# EAGLE schematic jr-support_v4 (EAGLE 8.2.2)
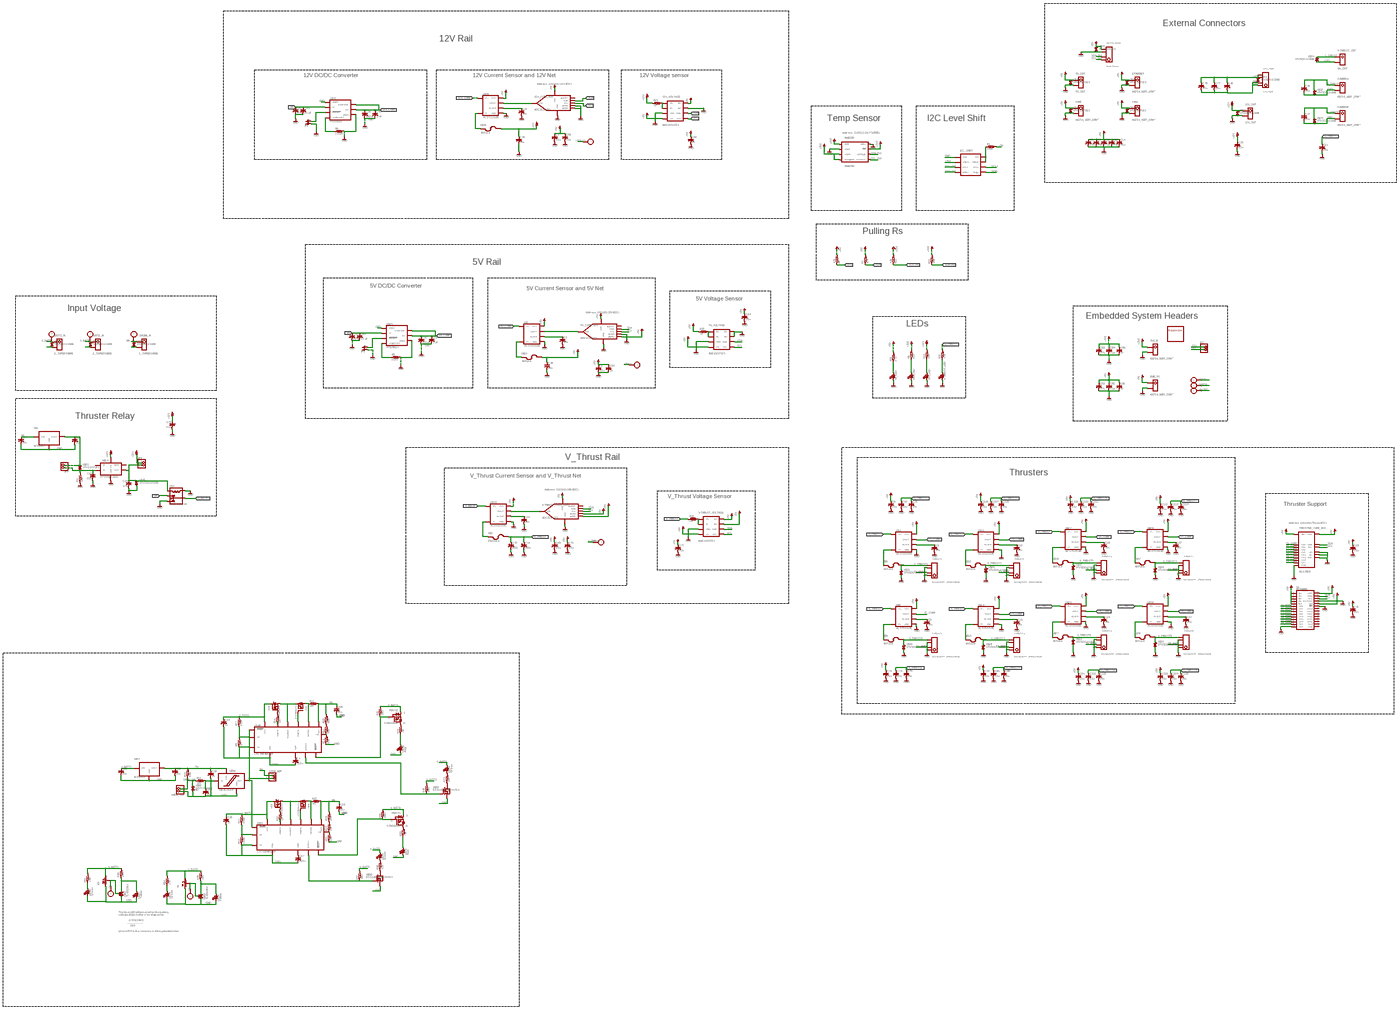
[diagram p0: schematic, sheet 1, overview]
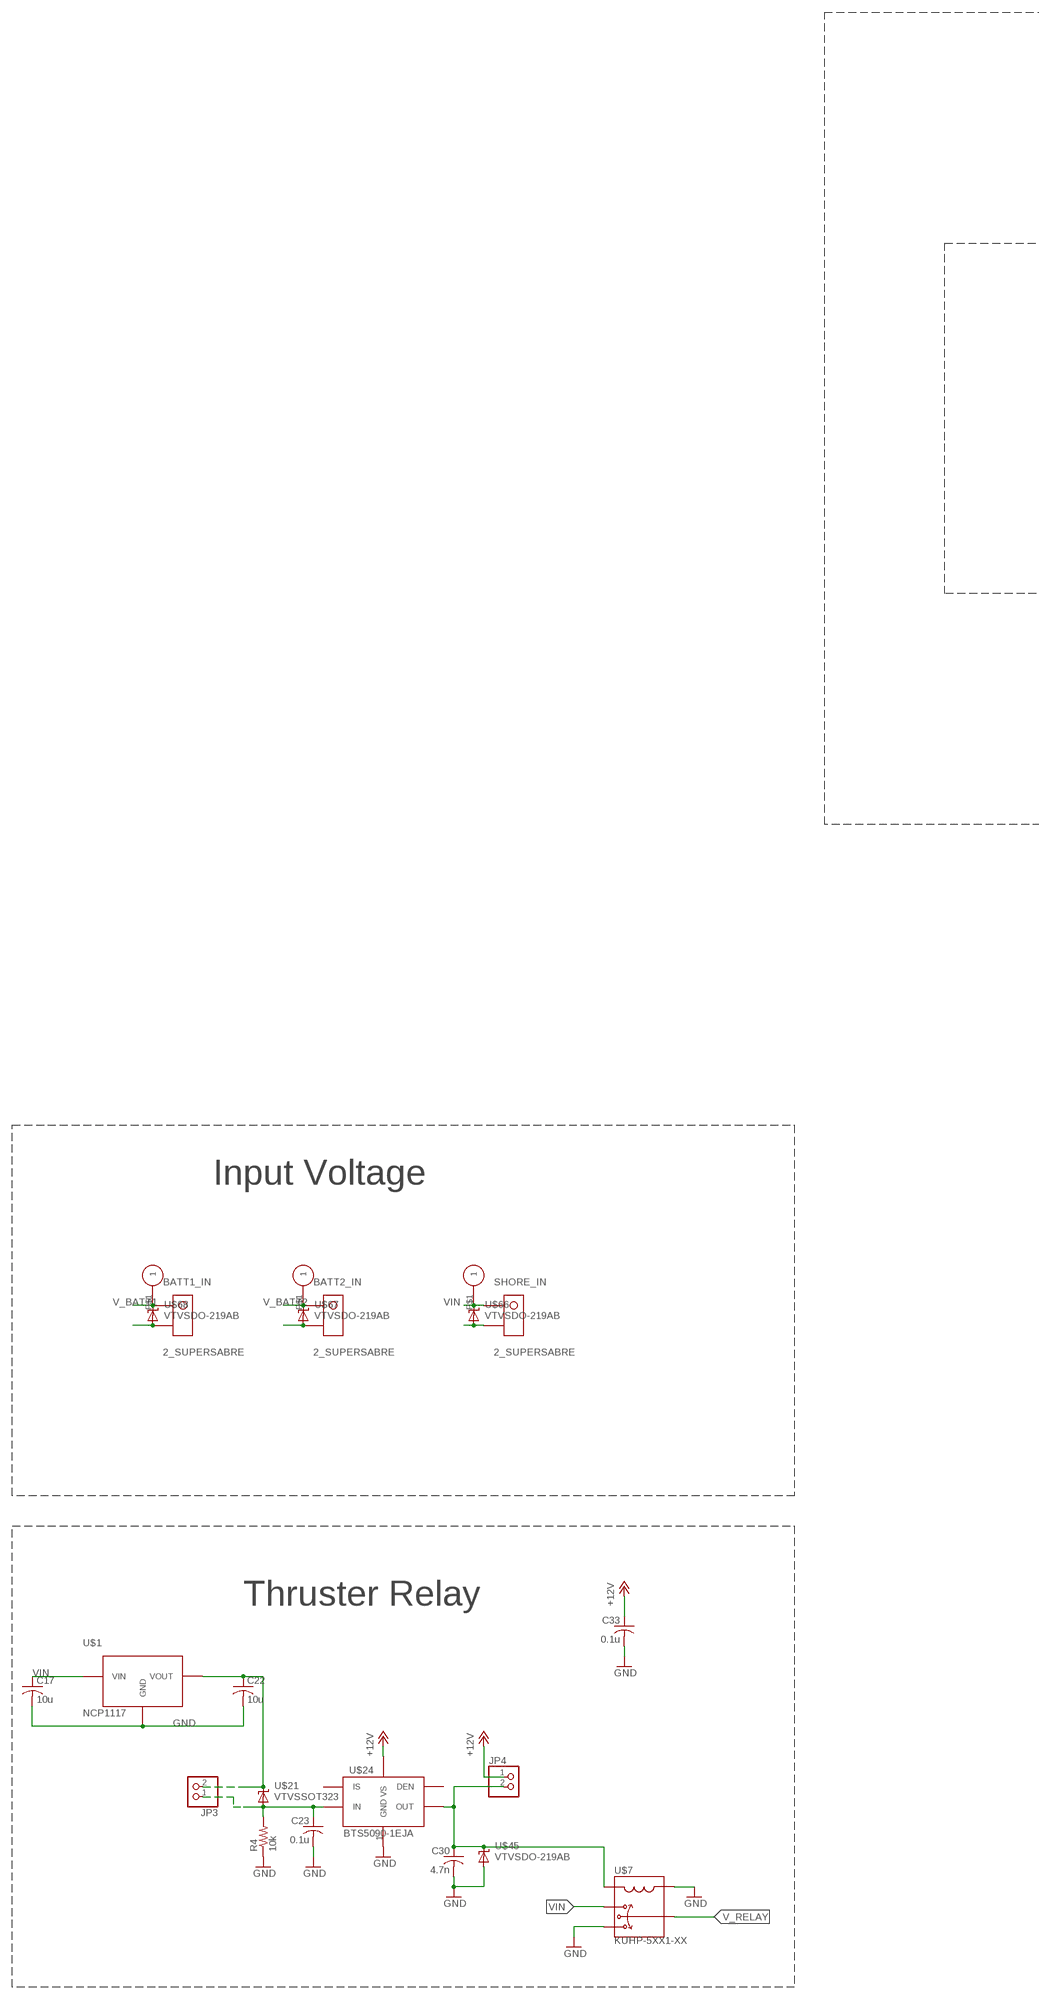
[diagram p1: schematic, sheet 1, part 1 of 8]
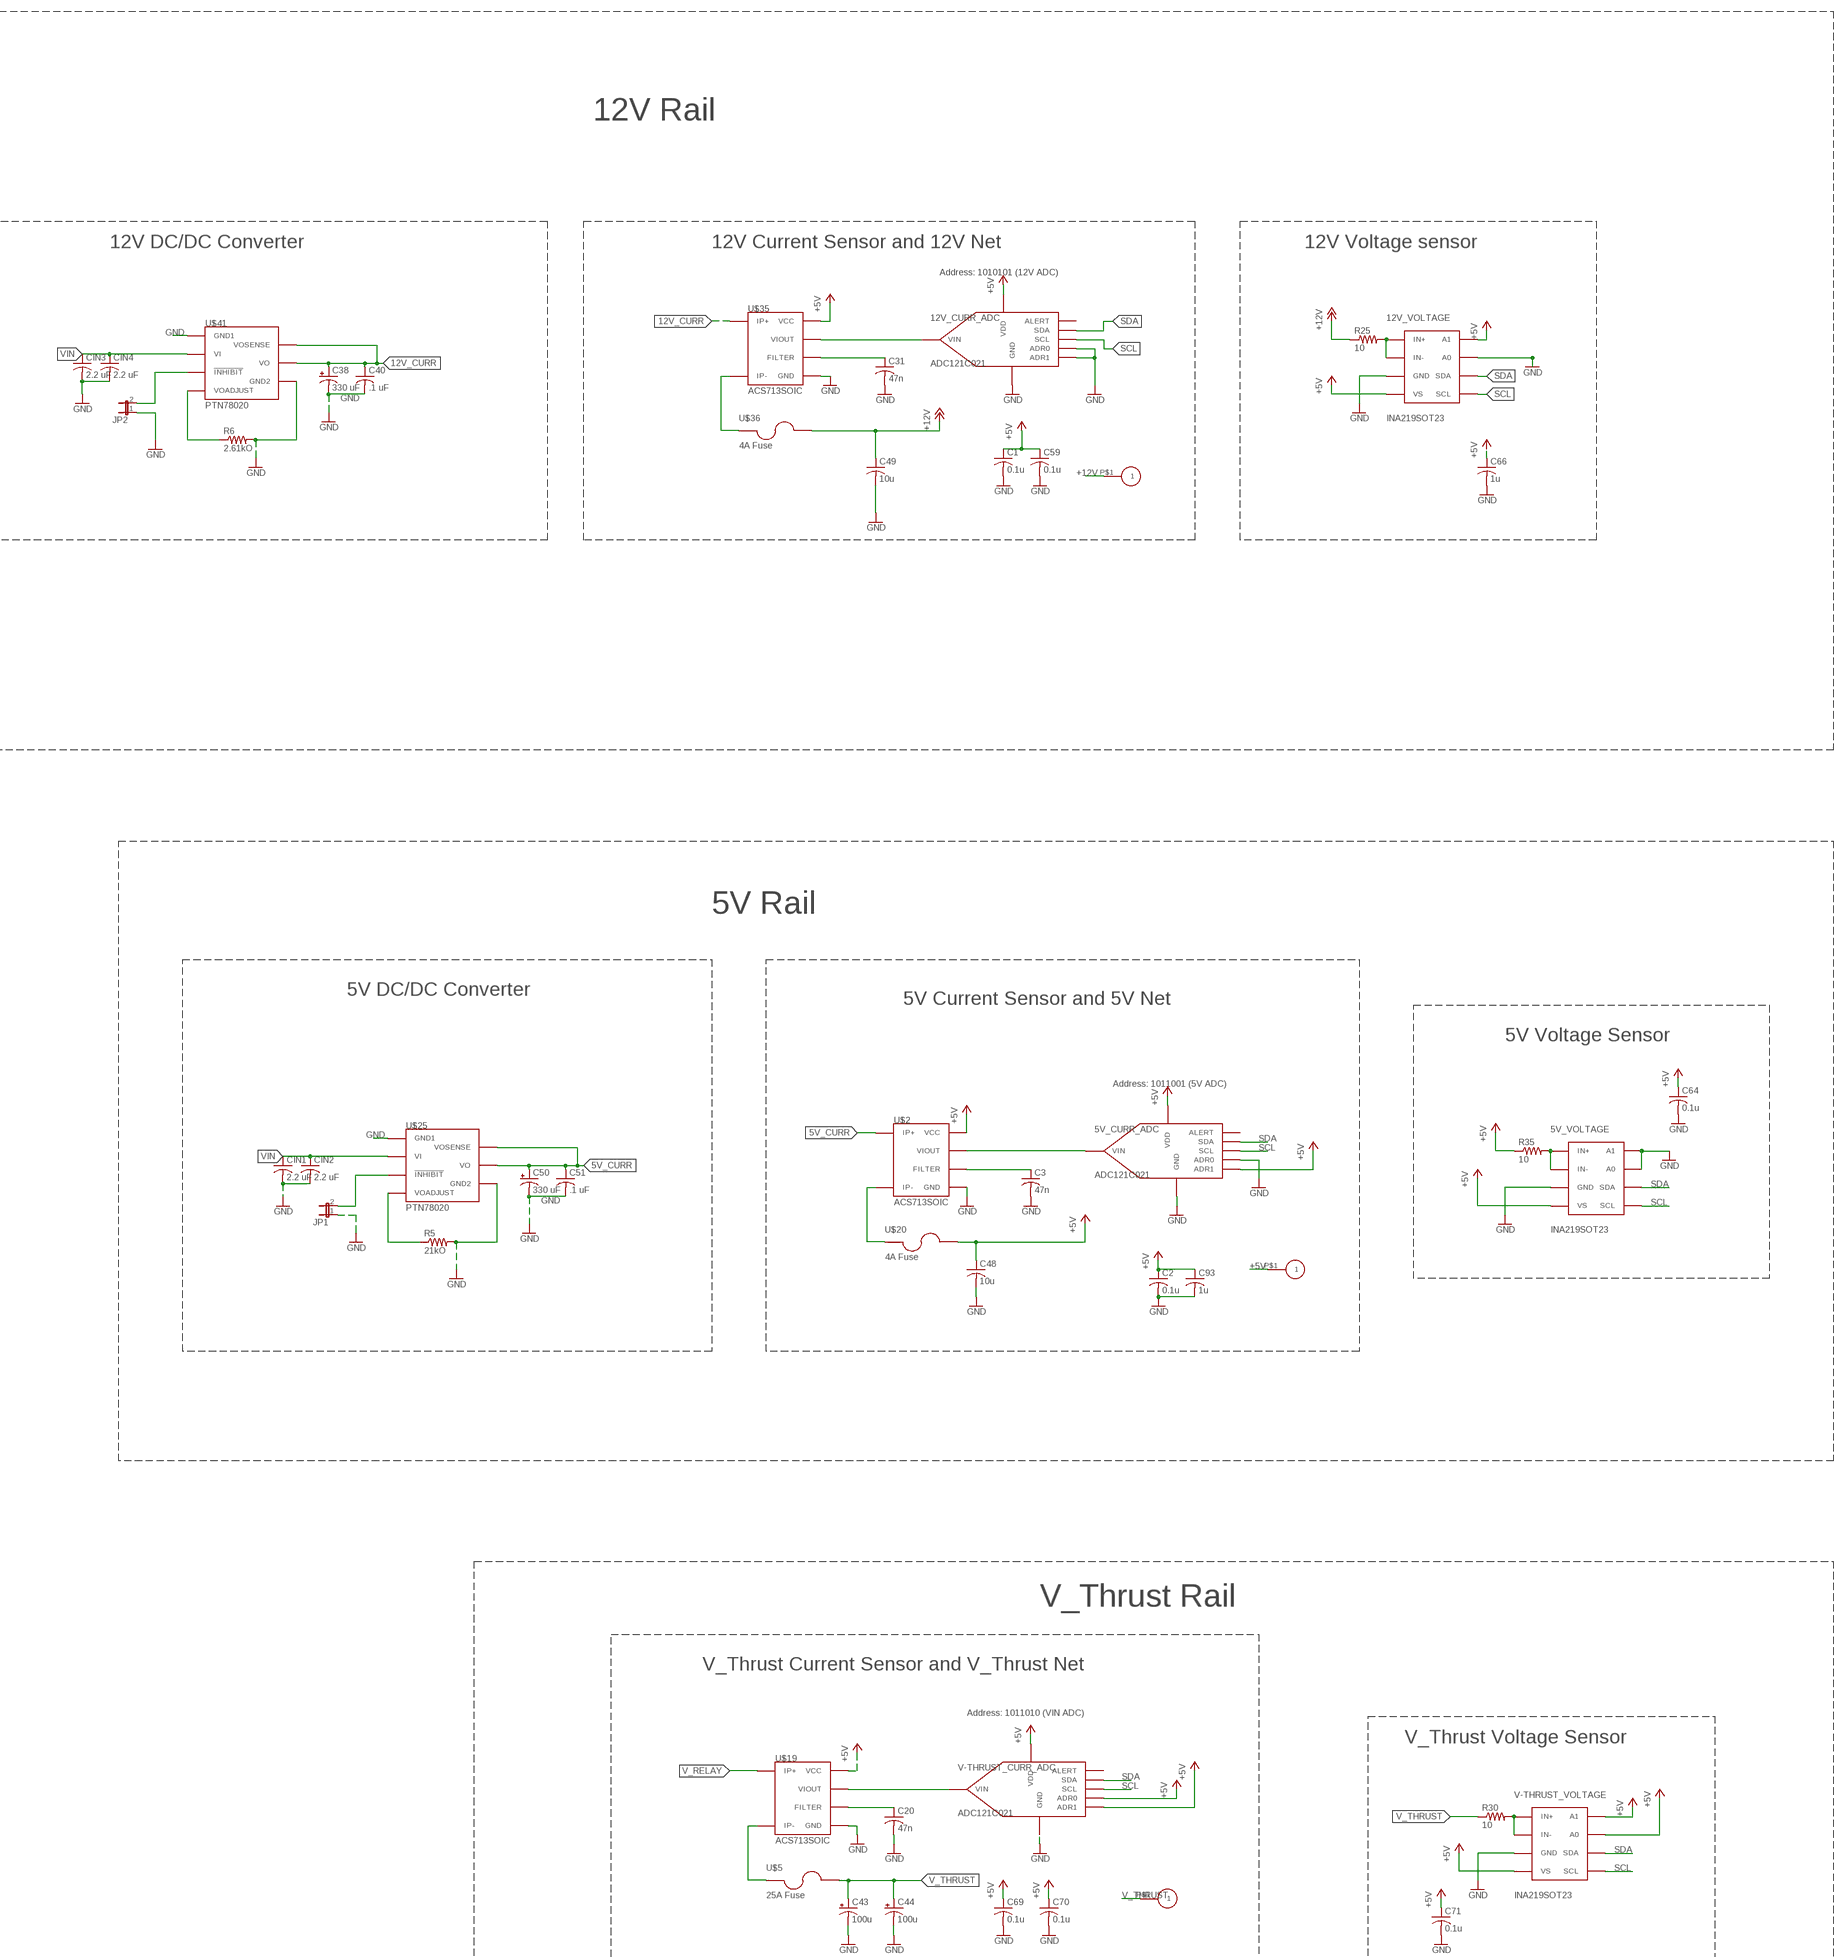
[diagram p2: schematic, sheet 1, part 2 of 8]
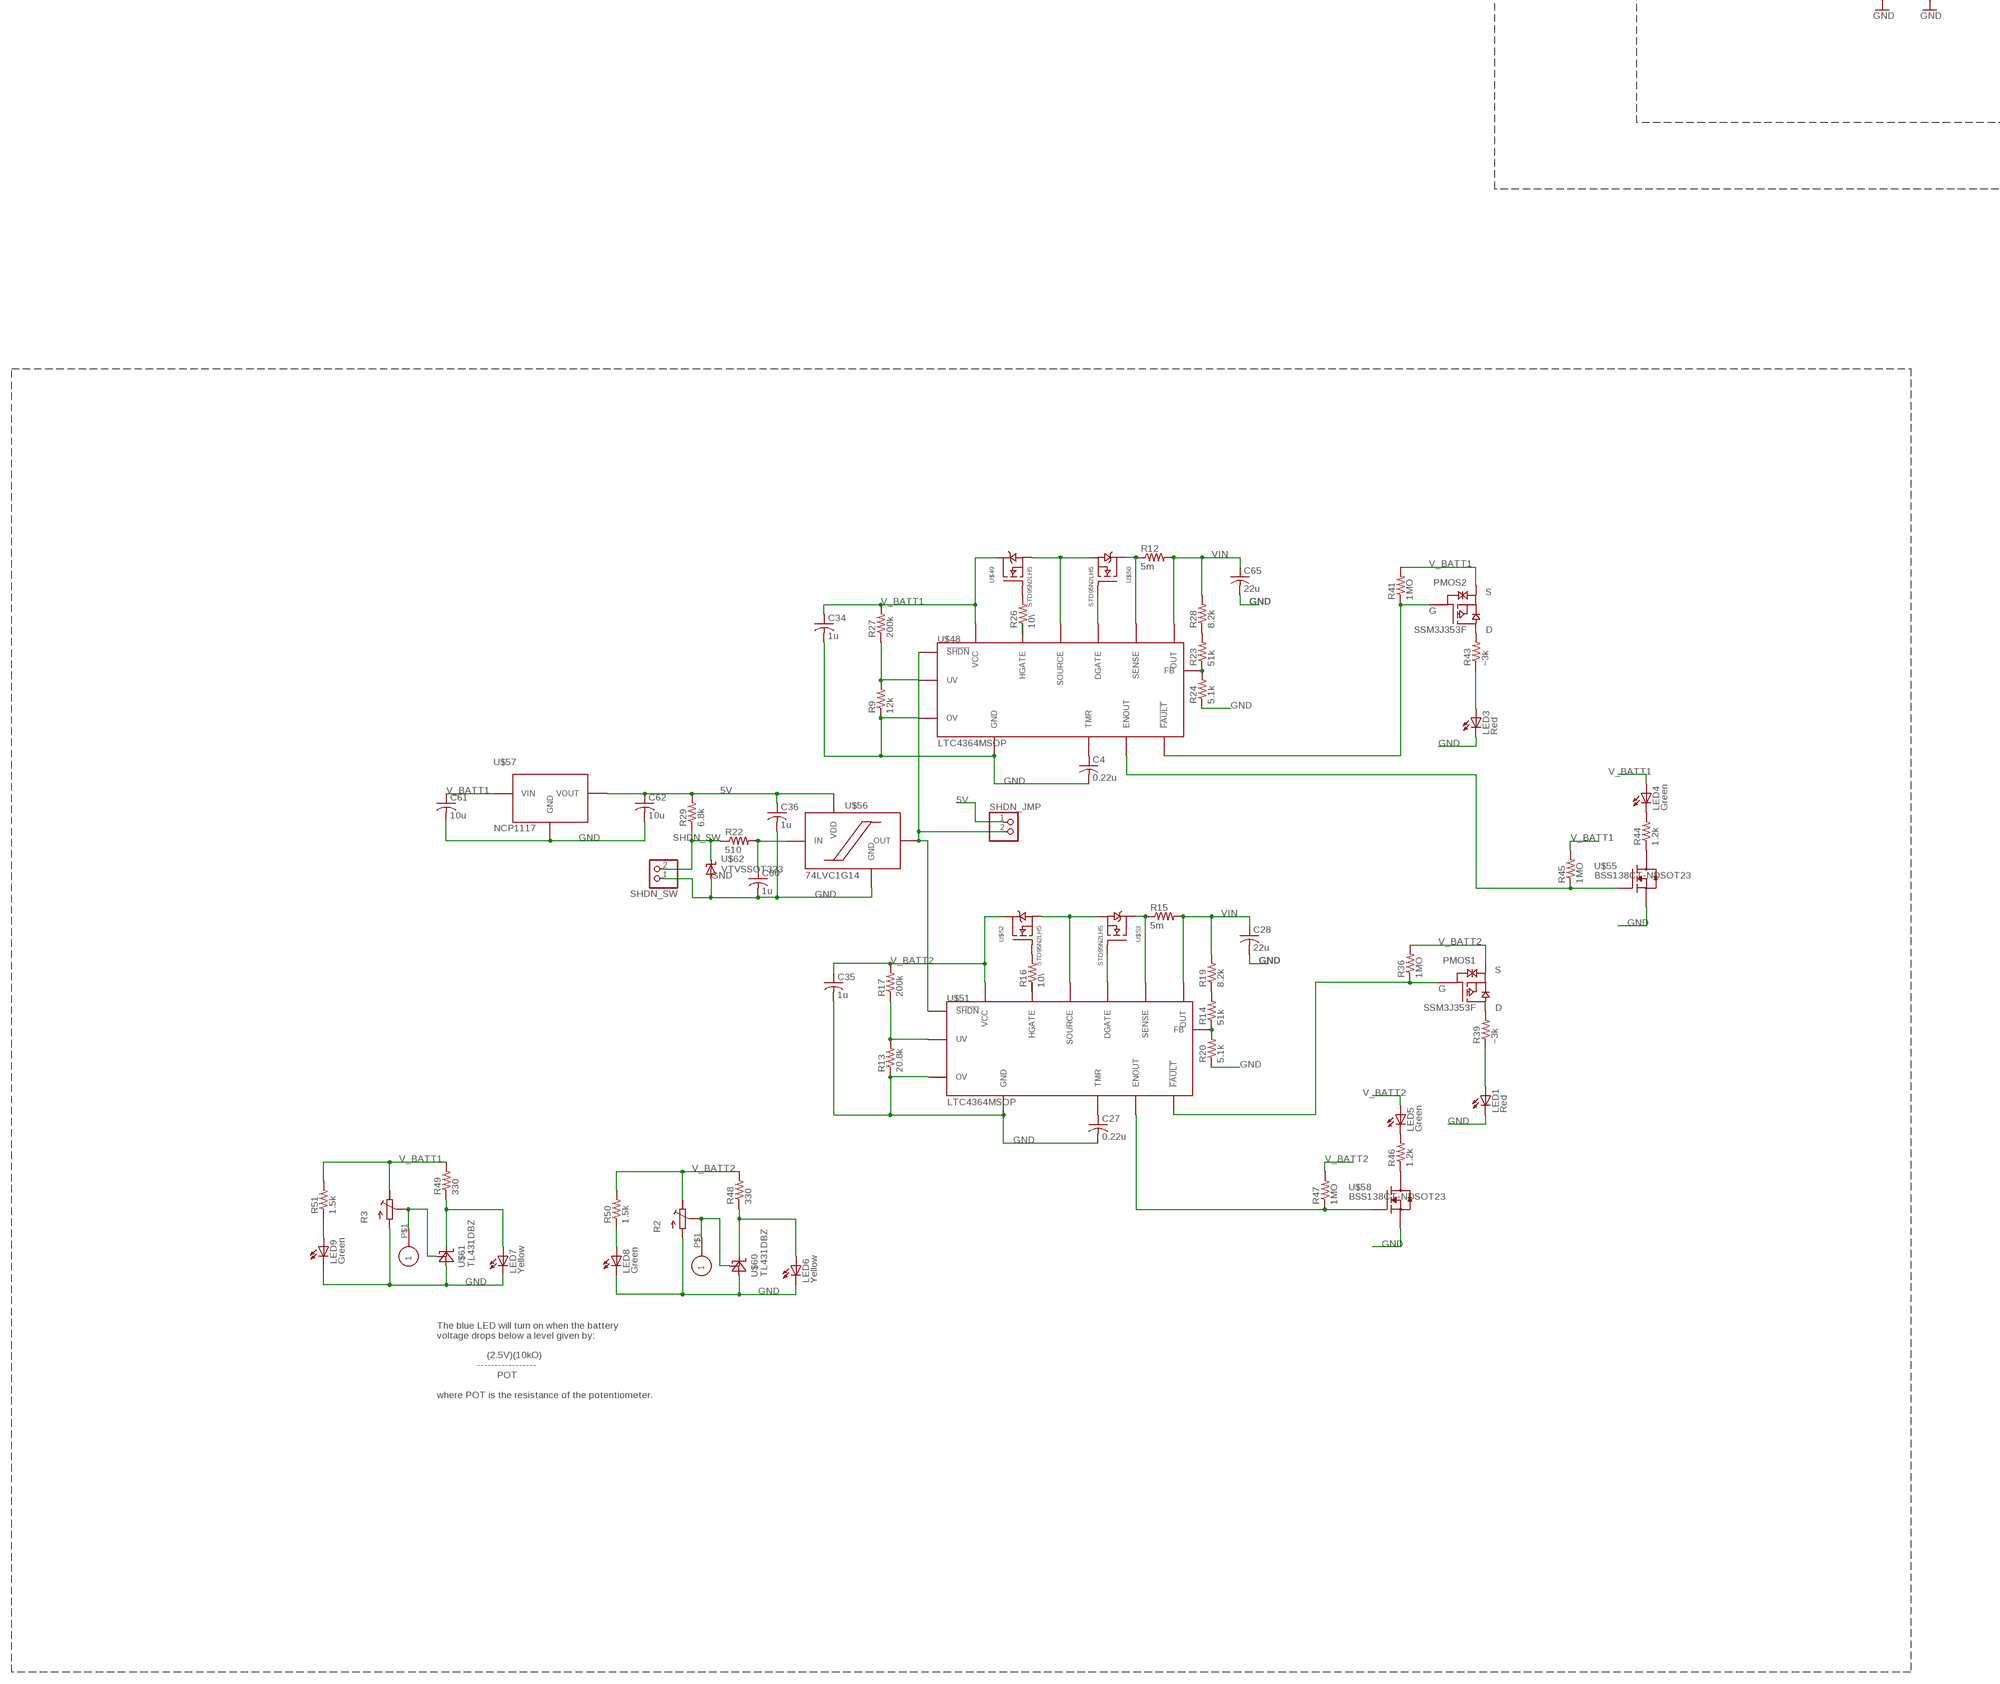
[diagram p3: schematic, sheet 1, part 3 of 8]
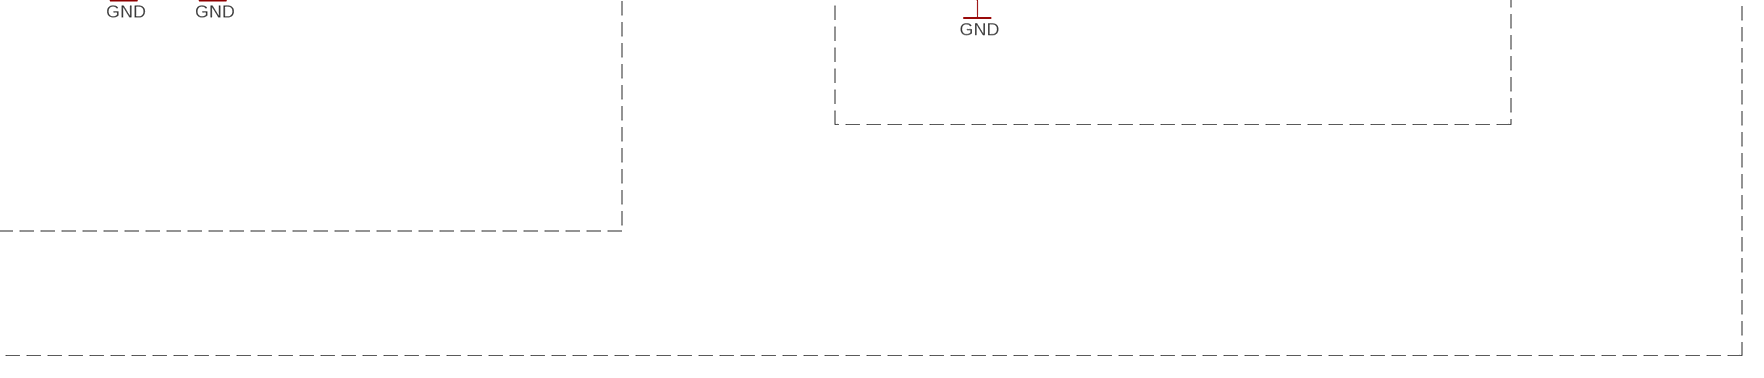
[diagram p4: schematic, sheet 1, part 4 of 8]
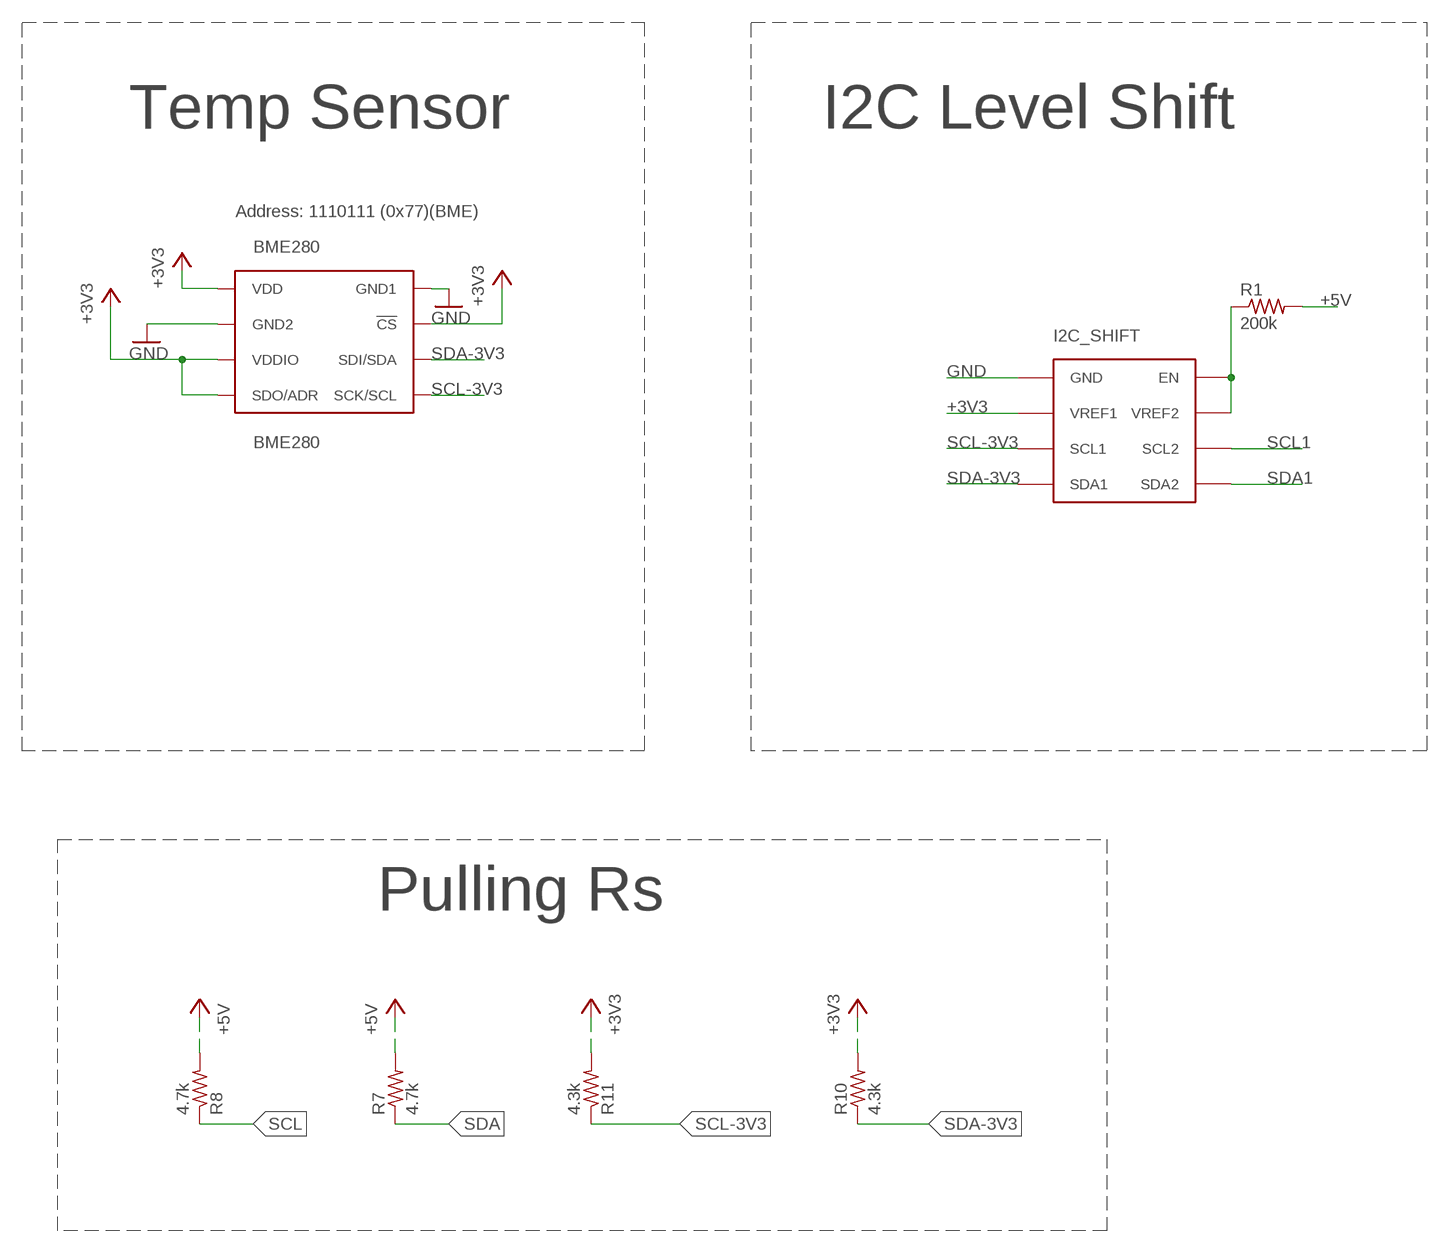
[diagram p5: schematic, sheet 1, part 5 of 8]
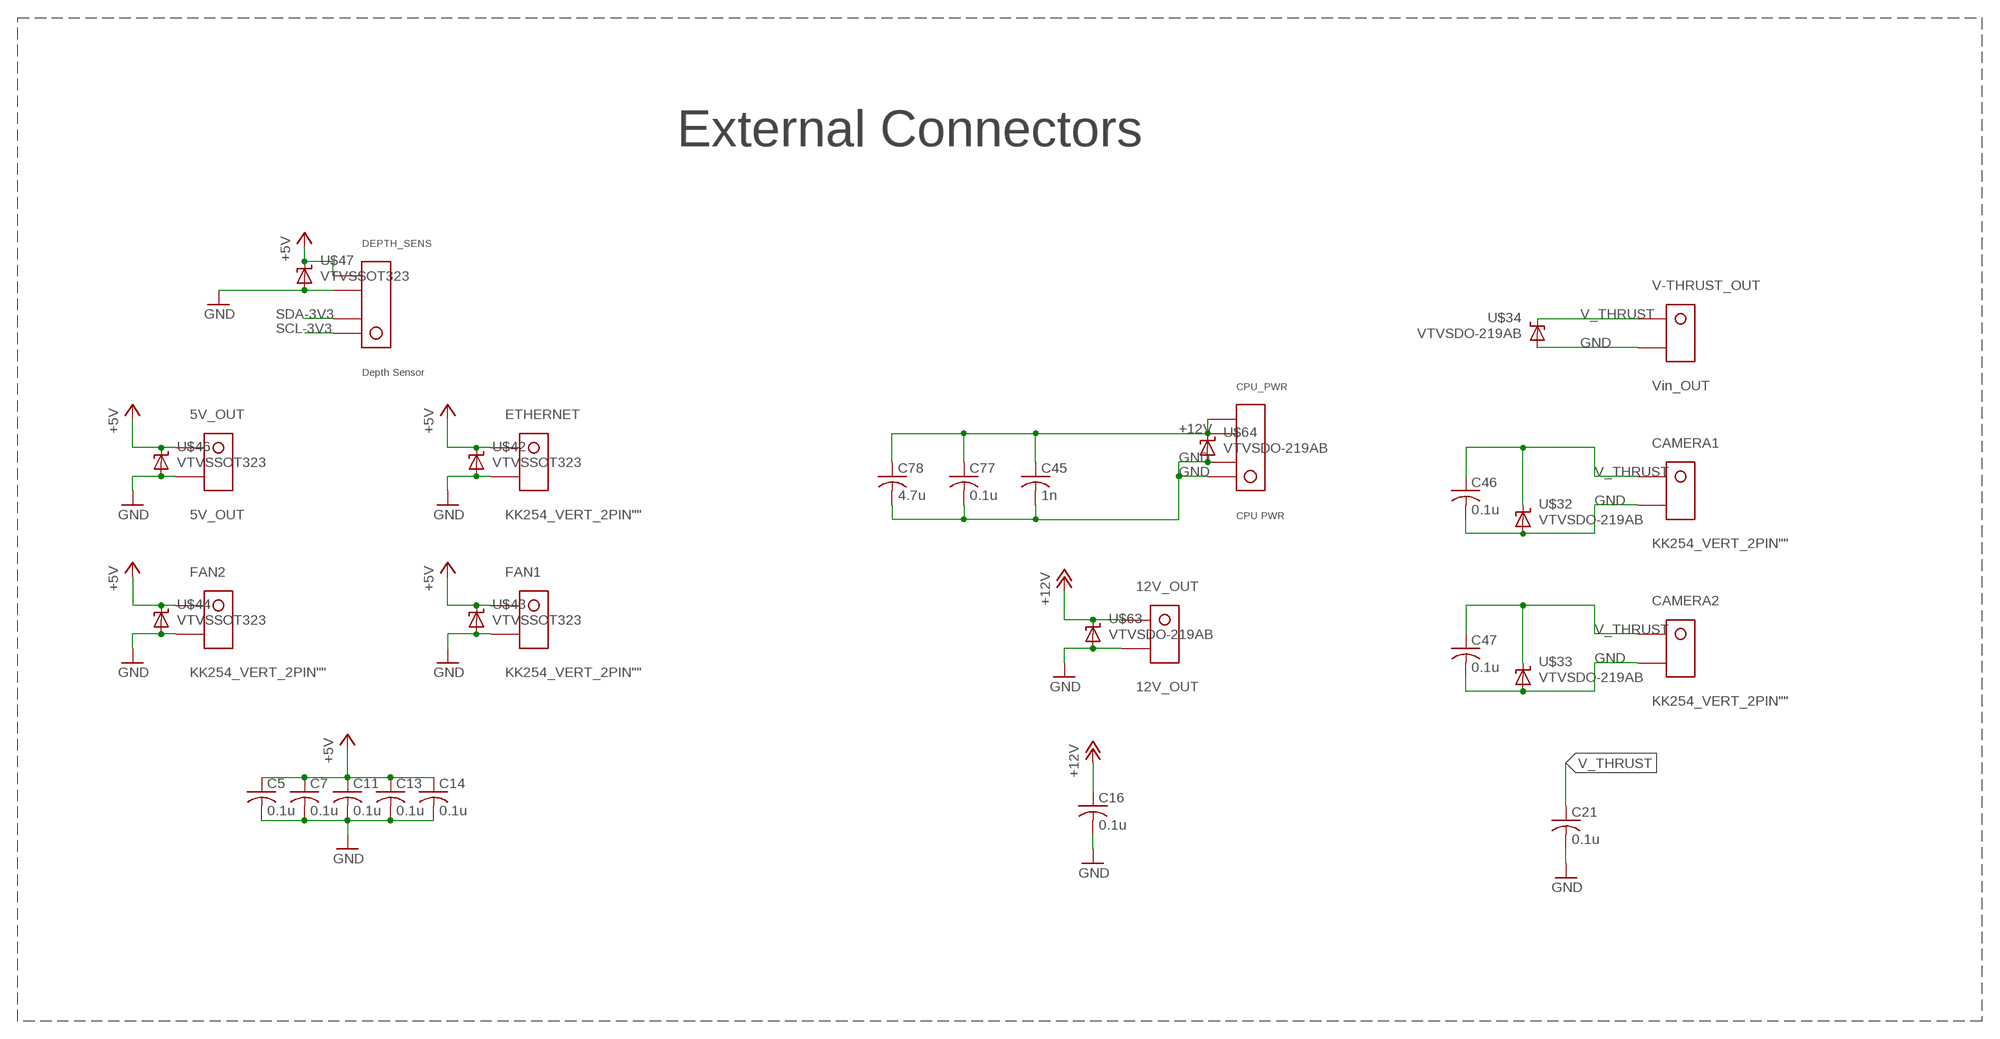
[diagram p6: schematic, sheet 1, part 6 of 8]
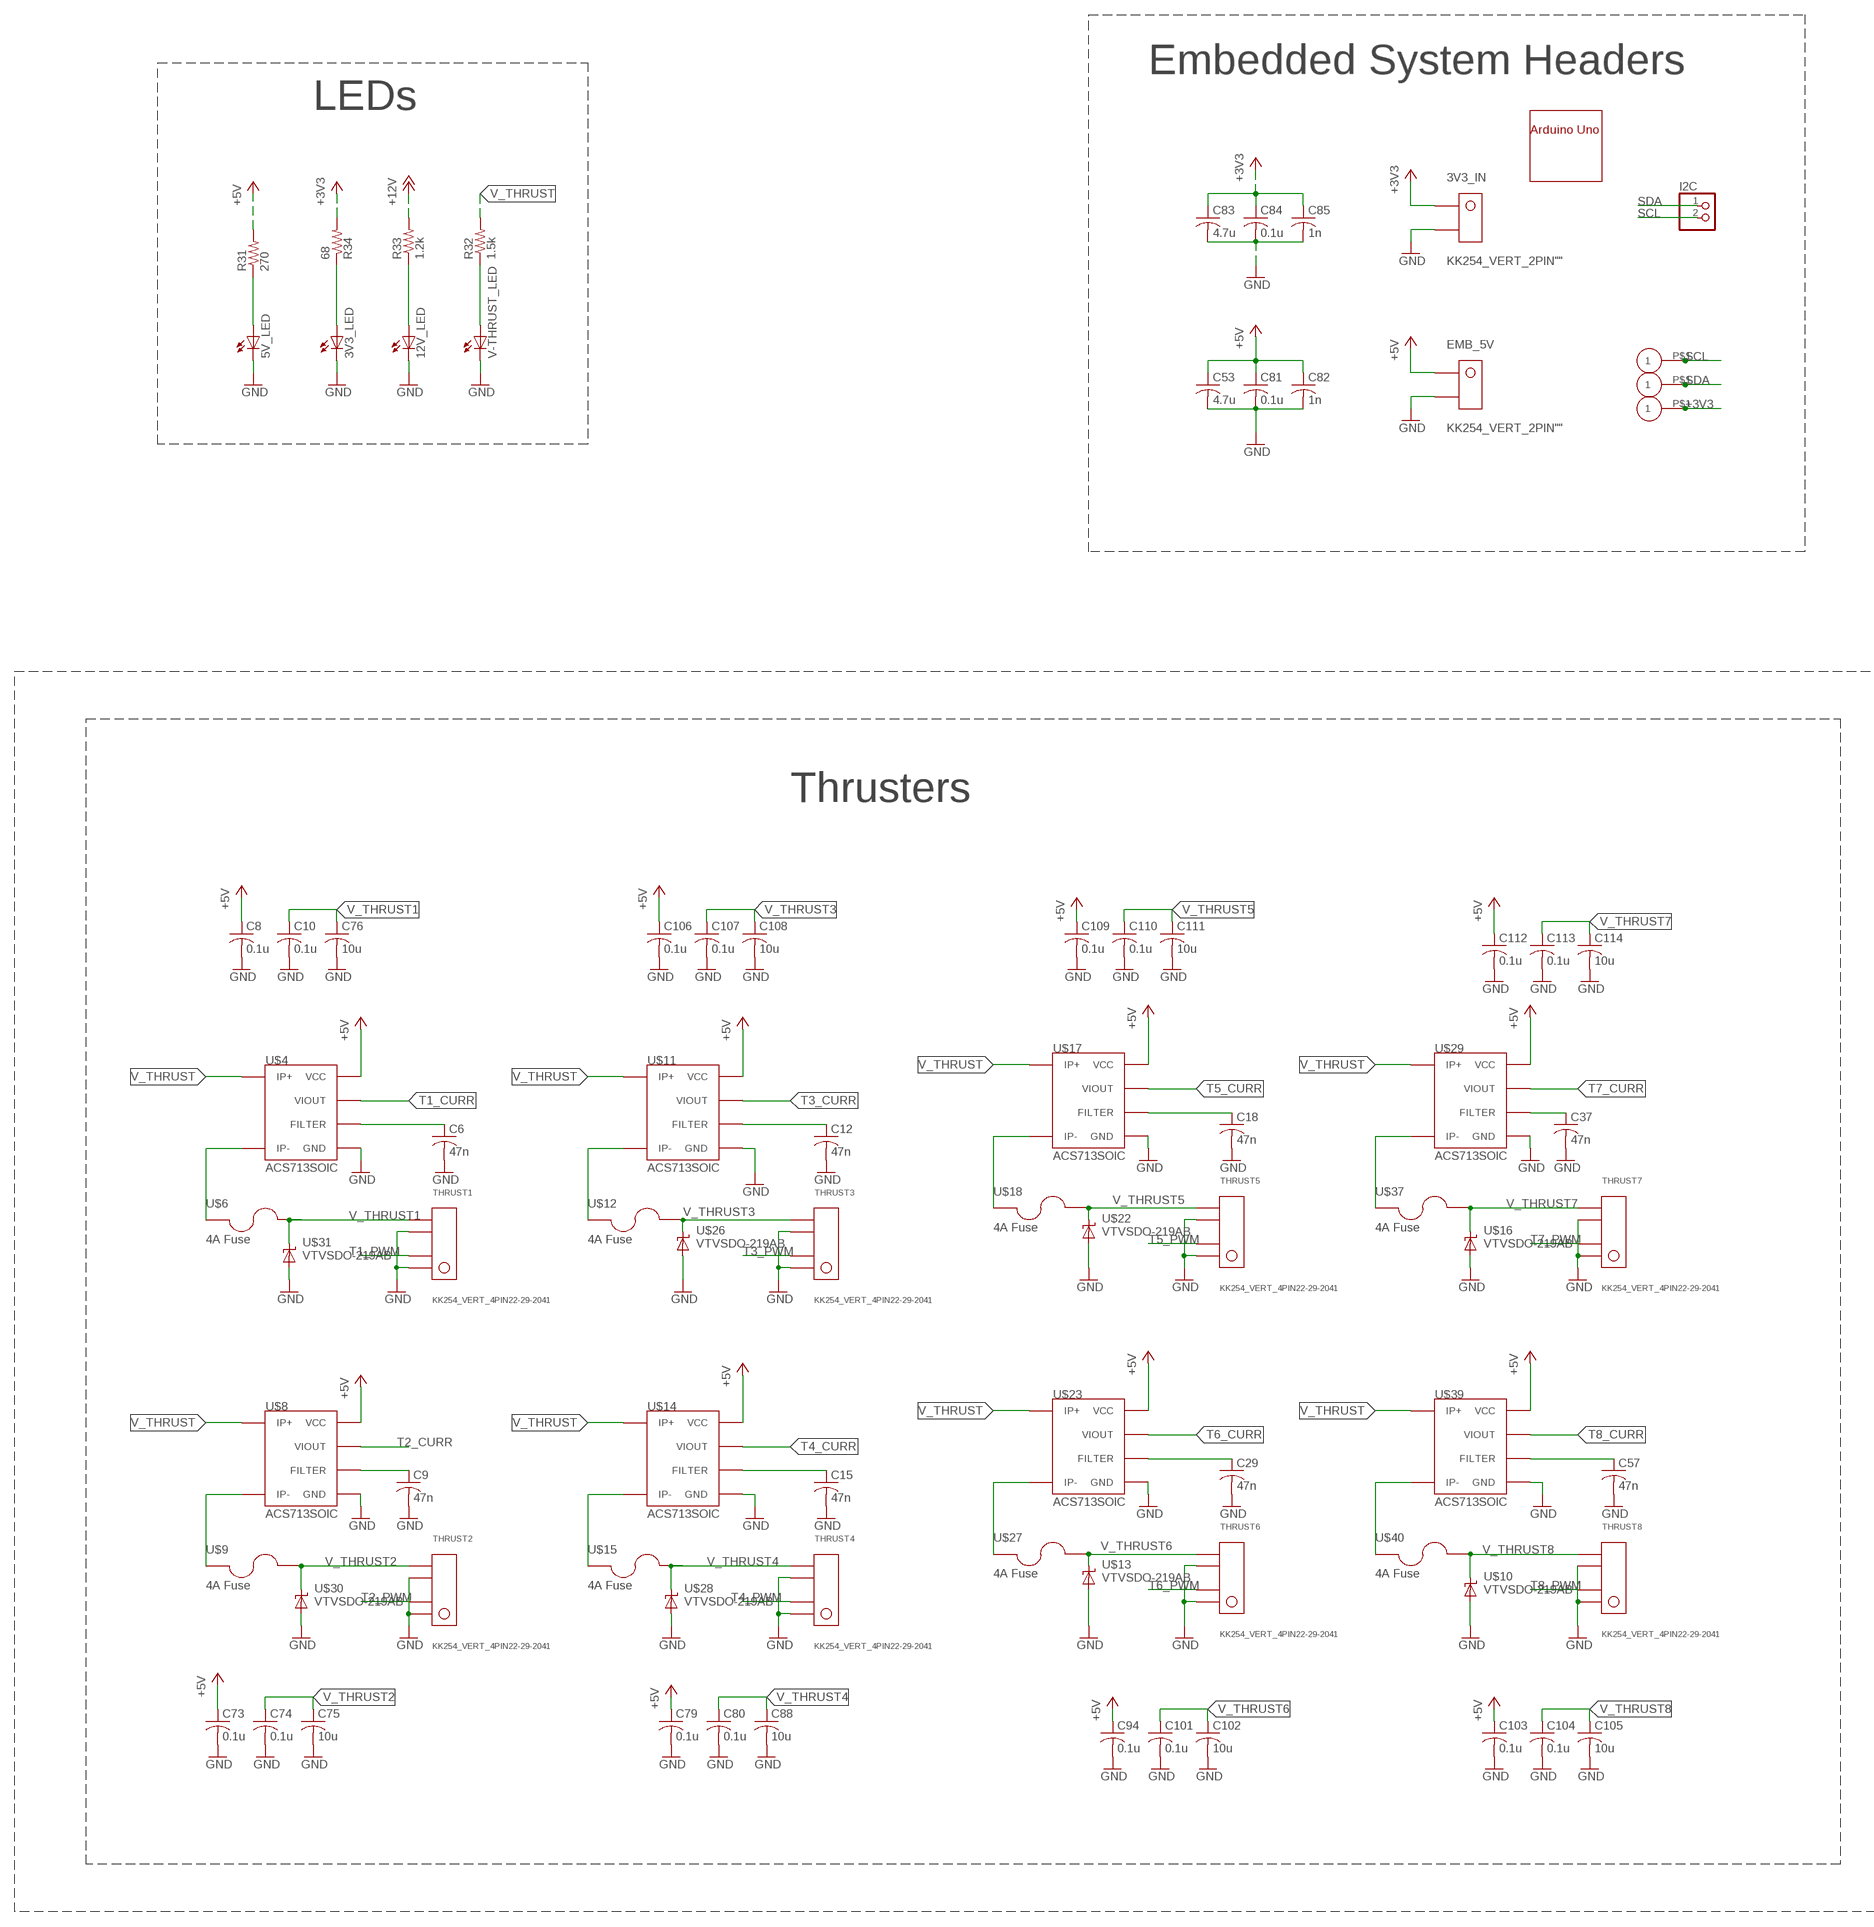
[diagram p7: schematic, sheet 1, part 7 of 8]
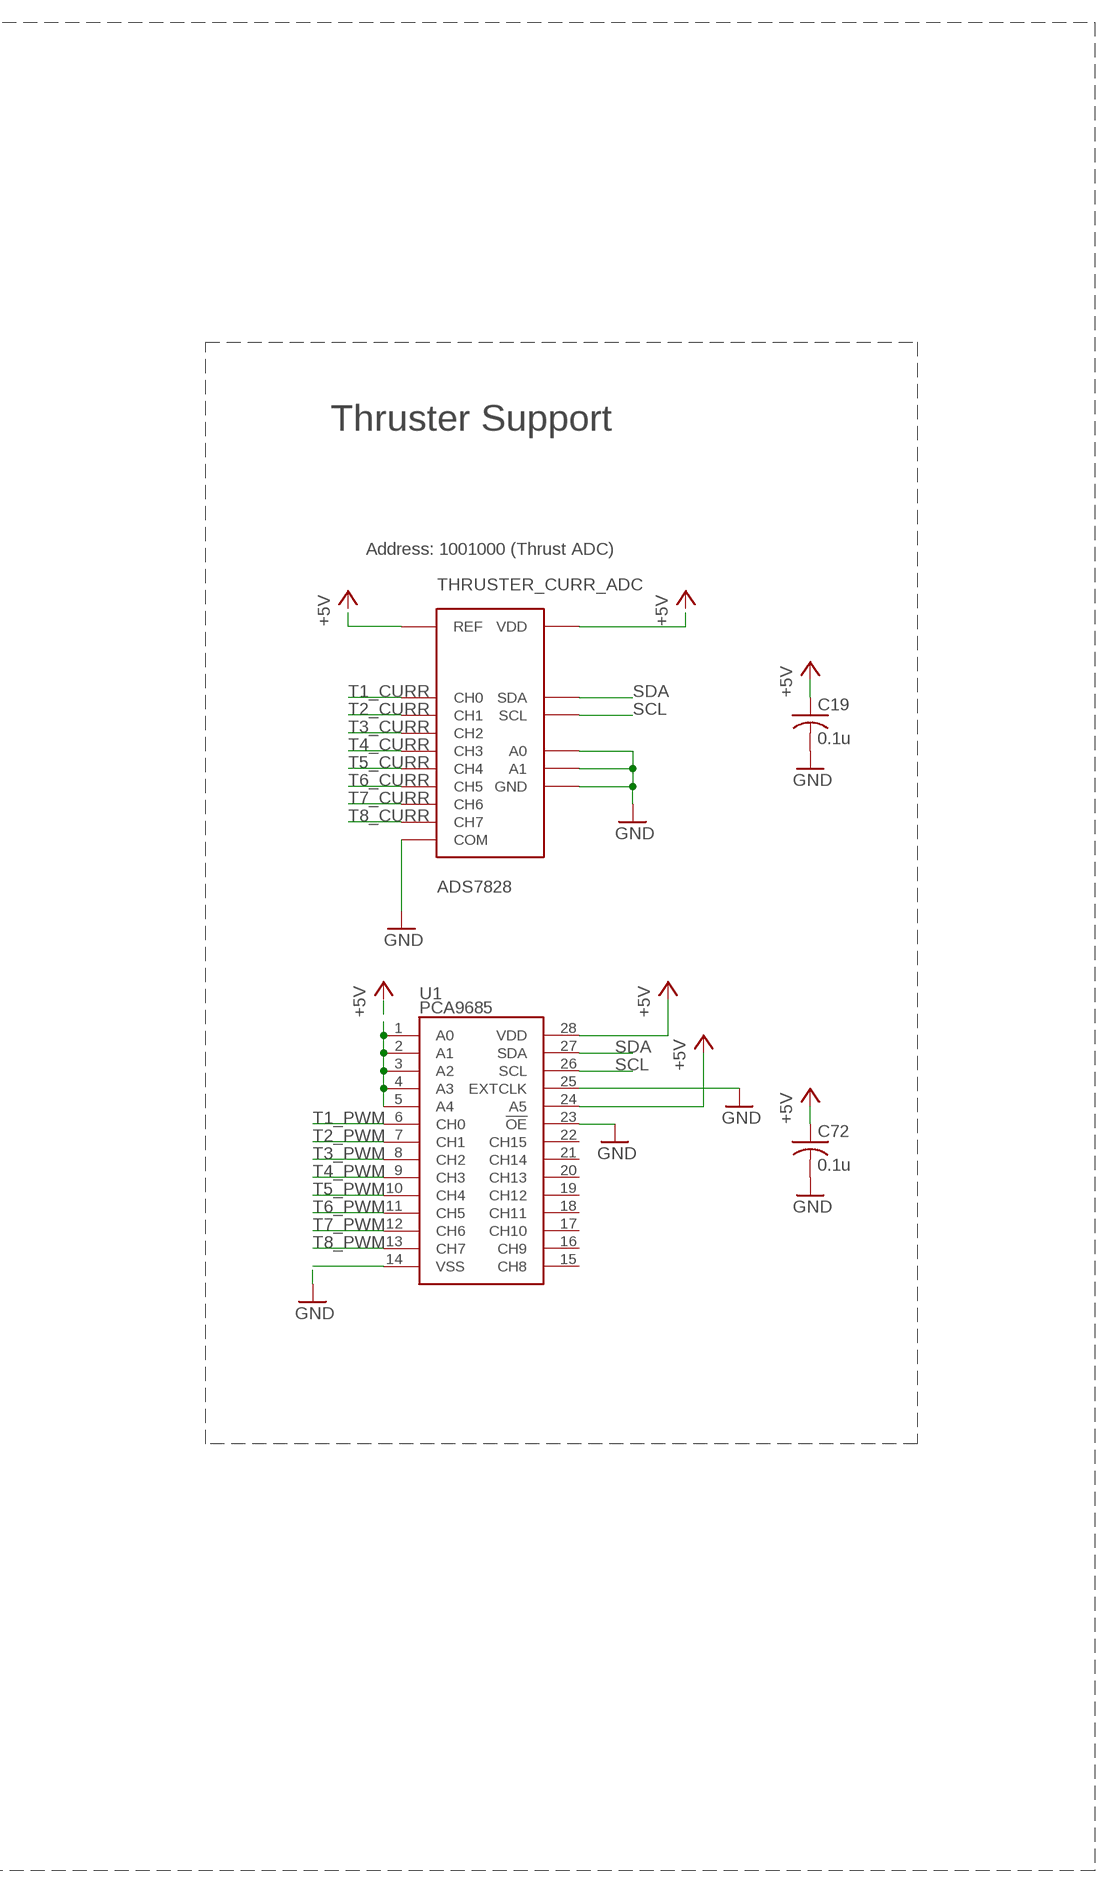
[diagram p8: schematic, sheet 1, part 8 of 8]

## Parts
3V3_IN  KK254_VERT_2PIN""  [KK254_VERT_2PIN]
3V3_LED  0805_LED  [0805]
5V_CURR_ADC  ADC121C021  [VSSOP-8]
5V_LED  0805_LED  [0805]
5V_OUT  5V_OUT  KK254_VERT_2PIN""  [KK254_VERT_2PIN]
5V_VOLTAGE  INA219SOT23  [SOT-23-8]
12V_CURR_ADC  ADC121C021  [VSSOP-8]
12V_LED  0805_LED  [0805]
12V_OUT  12V_OUT  KK254_VERT_2PIN""  [KK254_VERT_2PIN]
12V_VOLTAGE  INA219SOT23  [SOT-23-8]
BATT1_IN  2_SUPERSABRE  [SUPERSABRE_2CIRCUIT]
BATT2_IN  2_SUPERSABRE  [SUPERSABRE_2CIRCUIT]
BME280  BME280  [BME280_LGA]
C1  0.1u  C-USC0805  [C0805]
C2  0.1u  C-USC0805  [C0805]
C3  47n  C-USC0805  [C0805]
C4  0.22u  C-USC0805  [C0805]
C5  0.1u  C-USC0805  [C0805]
C6  47n  C-USC0805  [C0805]
C7  0.1u  C-USC0805  [C0805]
C8  0.1u  C-USC0805  [C0805]
C9  47n  C-USC0805  [C0805]
C10  0.1u  C-USC0805  [C0805]
C11  0.1u  C-USC0805  [C0805]
C12  47n  C-USC0805  [C0805]
C13  0.1u  C-USC0805  [C0805]
C14  0.1u  C-USC0805  [C0805]
C15  47n  C-USC0805  [C0805]
C16  0.1u  C-USC0805  [C0805]
C17  10u  C-USC0805  [C0805]
C18  47n  C-USC0805  [C0805]
C19  0.1u  C-USC0805  [C0805]
C20  47n  C-USC0805  [C0805]
C21  0.1u  C-USC0805  [C0805]
C22  10u  C-USC0805  [C0805]
C23  0.1u  C-USC0805  [C0805]
C27  0.22u  C-USC0805  [C0805]
C28  22u  C-USC0805  [C0805]
C29  47n  C-USC0805  [C0805]
C30  4.7n  C-USC0805  [C0805]
C31  47n  C-USC0805  [C0805]
C33  0.1u  C-USC0805  [C0805]
C34  1u  C-USC0805  [C0805]
C35  1u  C-USC0805  [C0805]
C36  1u  C-USC0805  [C0805]
C37  47n  C-USC0805  [C0805]
C38  330 uF  CPOL-USCKR_D10  [CKR_D10]
C40  .1 uF  C-USC0805  [C0805]
C43  100u  CPOL-US140CLH-0810  [140CLH-0810]
C44  100u  CPOL-US140CLH-0810  [140CLH-0810]
C45  1n  C-USC0805  [C0805]
C46  0.1u  C-USC0805  [C0805]
C47  0.1u  C-USC0805  [C0805]
C48  10u  C-USC0805  [C0805]
C49  10u  C-USC0805  [C0805]
C50  330 uF  CPOL-USCKR_D10  [CKR_D10]
C51  .1 uF  C-USC0805  [C0805]
C53  4.7u  C-USC0805  [C0805]
C57  47n  C-USC0805  [C0805]
C59  0.1u  C-USC0805  [C0805]
C60  1u  C-USC0805  [C0805]
C61  10u  C-USC0805  [C0805]
C62  10u  C-USC0805  [C0805]
C64  0.1u  C-USC0805  [C0805]
C65  22u  C-USC0805  [C0805]
C66  1u  C-USC0805  [C0805]
C69  0.1u  C-USC0805  [C0805]
C70  0.1u  C-USC0805  [C0805]
C71  0.1u  C-USC0805  [C0805]
C72  0.1u  C-USC0805  [C0805]
C73  0.1u  C-USC0805  [C0805]
C74  0.1u  C-USC0805  [C0805]
C75  10u  C-USC0805  [C0805]
C76  10u  C-USC0805  [C0805]
C77  0.1u  C-USC0805  [C0805]
C78  4.7u  C-USC0805  [C0805]
C79  0.1u  C-USC0805  [C0805]
C80  0.1u  C-USC0805  [C0805]
C81  0.1u  C-USC0805  [C0805]
C82  1n  C-USC0805  [C0805]
C83  4.7u  C-USC0805  [C0805]
C84  0.1u  C-USC0805  [C0805]
C85  1n  C-USC0805  [C0805]
C88  10u  C-USC0805  [C0805]
C93  1u  C-USC0805  [C0805]
C94  0.1u  C-USC0805  [C0805]
C101  0.1u  C-USC0805  [C0805]
C102  10u  C-USC0805  [C0805]
C103  0.1u  C-USC0805  [C0805]
C104  0.1u  C-USC0805  [C0805]
C105  10u  C-USC0805  [C0805]
C106  0.1u  C-USC0805  [C0805]
C107  0.1u  C-USC0805  [C0805]
C108  10u  C-USC0805  [C0805]
C109  0.1u  C-USC0805  [C0805]
C110  0.1u  C-USC0805  [C0805]
C111  10u  C-USC0805  [C0805]
C112  0.1u  C-USC0805  [C0805]
C113  0.1u  C-USC0805  [C0805]
C114  10u  C-USC0805  [C0805]
CAMERA1  KK254_VERT_2PIN""  [KK254_VERT_2PIN]
CAMERA2  KK254_VERT_2PIN""  [KK254_VERT_2PIN]
CIN1  2.2 uF  C-USC1210  [C1210]
CIN2  2.2 uF  C-USC1210  [C1210]
CIN3  2.2 uF  C-USC1210  [C1210]
CIN4  2.2 uF  C-USC1210  [C1210]
CPU_PWR  CPU PWR  KK254_VERT_4PIN22-29-2041  [KK254_VERT_4PIN]
DEPTH_SENS  Depth Sensor  KK254_VERT_4PIN22-29-2041  [KK254_VERT_4PIN]
EMB_5V  KK254_VERT_2PIN""  [KK254_VERT_2PIN]
ETHERNET  KK254_VERT_2PIN""  [KK254_VERT_2PIN]
FAN1  KK254_VERT_2PIN""  [KK254_VERT_2PIN]
FAN2  KK254_VERT_2PIN""  [KK254_VERT_2PIN]
I2C  PINHD-1X2  [1X02]
I2C_SHIFT  PCA9306DCT  [SM8]
JP1  JP1E  [JP1]
JP2  JP1E  [JP1]
JP3  PINHD-1X2  [1X02]
JP4  PINHD-1X2  [1X02]
LED1  Red  0805_LED  [0805]
LED3  Red  0805_LED  [0805]
LED4  Green  LEDCHIPLED_0805  [CHIPLED_0805]
LED5  Green  0805_LED  [0805]
LED6  Yellow  0805_LED  [0805]
LED7  Yellow  0805_LED  [0805]
LED8  Green  0805_LED  [0805]
LED9  Green  0805_LED  [0805]
PMOS1  SSM3J353F  [SOT-346-3/S-MINI]
PMOS2  SSM3J353F  [SOT-346-3/S-MINI]
R1  200k  R-US_R0805  [R0805]
R2  R-TRIMM3314J  [RTRIM3314J]
R3  R-TRIMM3314J  [RTRIM3314J]
R4  10k  R-US_R0805  [R0805]
R5  21kO  R-US_RC55/H8  [RC55]
R6  2.61kO  R-US_RC55/H8  [RC55]
R7  4.7k  R-US_R0805  [R0805]
R8  4.7k  R-US_R0805  [R0805]
R9  12k  R-US_R0805  [R0805]
R10  4.3k  R-US_R0805  [R0805]
R11  4.3k  R-US_R0805  [R0805]
R12  5m  R-US_R0805  [R0805]
R13  20.8k  R-US_R0805  [R0805]
R14  51k  R-US_R0805  [R0805]
R15  5m  R-US_R0805  [R0805]
R16  10\  R-US_R0805  [R0805]
R17  200k  R-US_R0805  [R0805]
R19  8.2k  R-US_R0805  [R0805]
R20  5.1k  R-US_R0805  [R0805]
R22  510  R-US_R0805  [R0805]
R23  51k  R-US_R0805  [R0805]
R24  5.1k  R-US_R0805  [R0805]
R25  10  R-US_R0805  [R0805]
R26  10\  R-US_R0805  [R0805]
R27  200k  R-US_R0805  [R0805]
R28  8.2k  R-US_R0805  [R0805]
R29  6.8k  R-US_R0805  [R0805]
R30  10  R-US_R0805  [R0805]
R31  270  R-US_R0805  [R0805]
R32  1.5k  R-US_R0805  [R0805]
R33  1.2k  R-US_R0805  [R0805]
R34  68  R-US_R0805  [R0805]
R35  10  R-US_R0805  [R0805]
R36  1MO  R-US_R0805  [R0805]
R39  ~3k  R-US_R0805  [R0805]
R41  1MO  R-US_R0805  [R0805]
R43  ~3k  R-US_R0805  [R0805]
R44  1.2k  R-US_R0805  [R0805]
R45  1MO  R-US_R0805  [R0805]
R46  1.2k  R-US_R0805  [R0805]
R47  1MO  R-US_R0805  [R0805]
R48  330  R-US_R0805  [R0805]
R49  330  R-US_R0805  [R0805]
R50  1.5k  R-US_R0805  [R0805]
R51  1.5k  R-US_R0805  [R0805]
SHDN_JMP  PINHD-1X2  [1X02]
SHDN_SW  PINHD-1X2  [1X02]
SHORE_IN  2_SUPERSABRE  [SUPERSABRE_2CIRCUIT]
THRUST1  KK254_VERT_4PIN22-29-2041  [KK254_VERT_4PIN]
THRUST2  KK254_VERT_4PIN22-29-2041  [KK254_VERT_4PIN]
THRUST3  KK254_VERT_4PIN22-29-2041  [KK254_VERT_4PIN]
THRUST4  KK254_VERT_4PIN22-29-2041  [KK254_VERT_4PIN]
THRUST5  KK254_VERT_4PIN22-29-2041  [KK254_VERT_4PIN]
THRUST6  KK254_VERT_4PIN22-29-2041  [KK254_VERT_4PIN]
THRUST7  KK254_VERT_4PIN22-29-2041  [KK254_VERT_4PIN]
THRUST8  KK254_VERT_4PIN22-29-2041  [KK254_VERT_4PIN]
THRUSTER_CURR_ADC  ADS7828  [TSSOP16]
U1  PCA9685  [TSSOP-28_4MM]
U$1  NCP1117  [SOT-223]
U$2  ACS713SOIC  [ACS713-SOIC]
U$3  TEST_PT534-5004  [534-5004]
U$4  ACS713SOIC  [ACS713-SOIC]
U$5  25A Fuse  BOWED-1.25"-FUSECLIPS  [1.25"_FUSECLIPS]
U$6  4A Fuse  154-OMNI_BLOK  [154-OMNI-BLOK]
U$7  KUHP-5XX1-XX  [KUHP_6.35MM-QUICK-CONNECT]
U$8  ACS713SOIC  [ACS713-SOIC]
U$9  4A Fuse  154-OMNI_BLOK  [154-OMNI-BLOK]
U$10  VTVSDO-219AB  [DO-219AB]
U$11  ACS713SOIC  [ACS713-SOIC]
U$12  4A Fuse  154-OMNI_BLOK  [154-OMNI-BLOK]
U$13  VTVSDO-219AB  [DO-219AB]
U$14  ACS713SOIC  [ACS713-SOIC]
U$15  4A Fuse  154-OMNI_BLOK  [154-OMNI-BLOK]
U$16  VTVSDO-219AB  [DO-219AB]
U$17  ACS713SOIC  [ACS713-SOIC]
U$18  4A Fuse  154-OMNI_BLOK  [154-OMNI-BLOK]
U$19  ACS713SOIC  [ACS713-SOIC]
U$20  4A Fuse  154-OMNI_BLOK  [154-OMNI-BLOK]
U$21  VTVSSOT323  [SOT323-R]
U$22  VTVSDO-219AB  [DO-219AB]
U$23  ACS713SOIC  [ACS713-SOIC]
U$24  BTS5090-1EJA  [SOIC8+PAD]
U$25  PTN78020  [PTN]
U$26  VTVSDO-219AB  [DO-219AB]
U$27  4A Fuse  154-OMNI_BLOK  [154-OMNI-BLOK]
U$28  VTVSDO-219AB  [DO-219AB]
U$29  ACS713SOIC  [ACS713-SOIC]
U$30  VTVSDO-219AB  [DO-219AB]
U$31  VTVSDO-219AB  [DO-219AB]
U$32  VTVSDO-219AB  [DO-219AB]
U$33  VTVSDO-219AB  [DO-219AB]
U$34  VTVSDO-219AB  [DO-219AB]
U$35  ACS713SOIC  [ACS713-SOIC]
U$36  4A Fuse  154-OMNI_BLOK  [154-OMNI-BLOK]
U$37  4A Fuse  154-OMNI_BLOK  [154-OMNI-BLOK]
U$38  ARDUINO_UNO  [ARDUINO_UNO]
U$39  ACS713SOIC  [ACS713-SOIC]
U$40  4A Fuse  154-OMNI_BLOK  [154-OMNI-BLOK]
U$41  PTN78020  [PTN]
U$42  VTVSSOT323  [SOT323-R]
U$43  VTVSSOT323  [SOT323-R]
U$44  VTVSSOT323  [SOT323-R]
U$45  VTVSDO-219AB  [DO-219AB]
U$46  VTVSSOT323  [SOT323-R]
U$47  VTVSSOT323  [SOT323-R]
U$48  LTC4364MSOP  [MSOP16]
U$49  STD95N2LH5  [DPAK]
U$50  STD95N2LH5  [DPAK]
U$51  LTC4364MSOP  [MSOP16]
U$52  STD95N2LH5  [DPAK]
U$53  STD95N2LH5  [DPAK]
U$54  TEST_PT534-5004  [534-5004]
U$55  BSS138CT-NDSOT23  [SOT23]
U$56  74LVC1G14  [TSSOP5]
U$57  NCP1117  [SOT-223]
U$58  BSS138CT-NDSOT23  [SOT23]
U$59  TEST_PT534-5004  [534-5004]
U$60  TL431DBZ  [SOT-23-3]
U$61  TL431DBZ  [SOT-23-3]
U$62  VTVSSOT323  [SOT323-R]
U$63  VTVSDO-219AB  [DO-219AB]
U$64  VTVSDO-219AB  [DO-219AB]
U$65  TEST_PT534-5004  [534-5004]
U$66  VTVSDO-219AB  [DO-219AB]
U$67  VTVSDO-219AB  [DO-219AB]
U$68  VTVSDO-219AB  [DO-219AB]
U$69  TEST_PT534-5004  [534-5004]
U$70  TEST_PT534-5004  [534-5004]
U$71  TEST_PT534-5004  [534-5004]
U$72  TEST_PT534-5004  [534-5004]
U$73  TEST_PT534-5004  [534-5004]
U$74  TEST_PT534-5004  [534-5004]
U$75  TEST_PT534-5004  [534-5004]
V-THRUST_CURR_ADC  ADC121C021  [VSSOP-8]
V-THRUST_LED  0805_LED  [0805]
V-THRUST_OUT  Vin_OUT  KK254_VERT_2PIN""  [KK254_VERT_2PIN]
V-THRUST_VOLTAGE  INA219SOT23  [SOT-23-8]

## Nets
5V: C36.1 C62.1 R29.2 SHDN_JMP.1 U$56.P$5(VDD) U$57.P$2(VOUT) U$57.P$4(VOUT)
5V_CURR: C50.P$1(+) C51.1 U$2.P$1(IP+) U$2.P$2(IP+) U$25.P$5(VOSENSE) U$25.P$6(VO)
5V_RELAY: C22.1 JP3.2 U$1.P$2(VOUT) U$1.P$4(VOUT) U$21.1(C) U$21.2(C)
12V_CURR: C38.P$1(+) C40.1 U$35.P$1(IP+) U$35.P$2(IP+) U$41.P$5(VOSENSE) U$41.P$6(VO)
+3V3: 3V3_IN.P$1 BME280.P$2(!CS) BME280.P$5(SDO/ADR) BME280.P$6(VDDIO) BME280.P$8(VDD) C83.1 C84.1 C85.1 I2C_SHIFT.P$2(VREF1) R10.2 R11.2 R34.2 U$3.P$1
+5V: 5V_CURR_ADC.P$5(VDD) 5V_CURR_ADC.P$6(ADR1) 5V_OUT.P$1 5V_VOLTAGE.P$4(VS) 12V_CURR_ADC.P$5(VDD) 12V_VOLTAGE.P$4(VS) 12V_VOLTAGE.P$8(A1) C1.1 C2.1 C5.1 C7.1 C8.1 C11.1 C13.1 C14.1 C19.1 C48.1 C53.1 C59.1 C64.1 C66.1 C69.1 C70.1 C71.1 C72.1 C73.1 C79.1 C81.1 C82.1 C93.1 C94.1 C103.1 C106.1 C109.1 C112.1 DEPTH_SENS.P$4 EMB_5V.P$1 ETHERNET.P$1 FAN1.P$1 FAN2.P$1 R1.2 R7.2 R8.2 R31.2 R35.1 THRUSTER_CURR_ADC.10(REF) THRUSTER_CURR_ADC.16(VDD) U1.1(A0) U1.2(A1) U1.3(A2) U1.4(A3) U1.5(A4) U1.24(A5) U1.28(VDD) U$2.P$8(VCC) U$4.P$8(VCC) U$8.P$8(VCC) U$11.P$8(VCC) U$14.P$8(VCC) U$17.P$8(VCC) U$19.P$8(VCC) U$20.P$2 U$23.P$8(VCC) U$29.P$8(VCC) U$35.P$8(VCC) U$39.P$8(VCC) U$42.1(C) U$42.2(C) U$43.1(C) U$43.2(C) U$44.1(C) U$44.2(C) U$46.1(C) U$46.2(C) U$47.1(C) U$47.2(C) U$69.P$1 V-THRUST_CURR_ADC.P$3(ADR0) V-THRUST_CURR_ADC.P$5(VDD) V-THRUST_CURR_ADC.P$6(ADR1) V-THRUST_VOLTAGE.P$4(VS) V-THRUST_VOLTAGE.P$7(A0) V-THRUST_VOLTAGE.P$8(A1)
+12V: 12V_OUT.P$1 C16.1 C33.1 C45.1 C49.1 C77.1 C78.1 CPU_PWR.P$3 CPU_PWR.P$4 JP4.1 R25.1 R33.2 U$24.PAD(VS) U$36.P$2 U$63.P$2(C) U$64.P$2(C) U$70.P$1
GND: 3V3_IN.P$2 3V3_LED.P$2(C) 5V_CURR_ADC.P$3(ADR0) 5V_CURR_ADC.P$7(GND) 5V_LED.P$2(C) 5V_OUT.P$2 5V_VOLTAGE.P$3(GND) 5V_VOLTAGE.P$7(A0) 5V_VOLTAGE.P$8(A1) 12V_CURR_ADC.P$3(ADR0) 12V_CURR_ADC.P$6(ADR1) 12V_CURR_ADC.P$7(GND) 12V_LED.P$2(C) 12V_OUT.P$2 12V_VOLTAGE.P$3(GND) 12V_VOLTAGE.P$7(A0) BATT1_IN.P$2 BATT2_IN.P$2 BME280.P$1(GND1) BME280.P$7(GND2) C1.2 C2.2 C3.2 C4.2 C5.2 C6.2 C7.2 C8.2 C9.2 C10.2 C11.2 C12.2 C13.2 C14.2 C15.2 C16.2 C17.2 C18.2 C19.2 C20.2 C21.2 C22.2 C23.2 C27.2 C28.2 C29.2 C30.2 C31.2 C33.2 C34.2 C35.2 C36.2 C37.2 C38.P$2(-) C40.2 C43.- C44.- C45.2 C46.2 C47.2 C48.2 C49.2 C50.P$2(-) C51.2 C53.2 C57.2 C59.2 C60.2 C61.2 C62.2 C64.2 C65.2 C66.2 C69.2 C70.2 C71.2 C72.2 C73.2 C74.2 C75.2 C76.2 C77.2 C78.2 C79.2 C80.2 C81.2 C82.2 C83.2 C84.2 C85.2 C88.2 C93.2 C94.2 C101.2 C102.2 C103.2 C104.2 C105.2 C106.2 C107.2 C108.2 C109.2 C110.2 C111.2 C112.2 C113.2 C114.2 CAMERA1.P$2 CAMERA2.P$2 CIN1.2 CIN2.2 CIN3.2 CIN4.2 CPU_PWR.P$1 CPU_PWR.P$2 DEPTH_SENS.P$3 EMB_5V.P$2 ETHERNET.P$2 FAN1.P$2 FAN2.P$2 I2C_SHIFT.P$1(GND) JP1.1 JP2.1 LED1.P$2(C) LED3.P$2(C) LED6.P$2(C) LED7.P$2(C) LED8.P$2(C) LED9.P$2(C) R2.1(E) R3.1(E) R4.1 R5.P$2 R6.P$2 R9.1 R13.1 R20.1 R24.1 SHDN_SW.1 SHORE_IN.P$2 THRUST1.P$1 THRUST1.P$3 THRUST2.P$1 THRUST2.P$3 THRUST3.P$1 THRUST3.P$3 THRUST4.P$1 THRUST4.P$3 THRUST5.P$1 THRUST5.P$3 THRUST6.P$1 THRUST6.P$3 THRUST7.P$1 THRUST7.P$3 THRUST8.P$1 THRUST8.P$3 THRUSTER_CURR_ADC.9(GND) THRUSTER_CURR_ADC.11(COM) THRUSTER_CURR_ADC.12(A0) THRUSTER_CURR_ADC.13(A1) U1.14(VSS) U1.23(!OE) U1.25(EXTCLK) U$1.P$1(GND) U$2.P$5(GND) U$4.P$5(GND) U$7.5A U$7.5B U$7.AA(A) U$7.AB(A) U$8.P$5(GND) U$10.P$1(A) U$11.P$5(GND) U$13.P$1(A) U$14.P$5(GND) U$16.P$1(A) U$17.P$5(GND) U$19.P$5(GND) U$22.P$1(A) U$23.P$5(GND) U$24.1(GND) U$25.P$1(GND1) U$25.P$7(GND2) U$26.P$1(A) U$28.P$1(A) U$29.P$5(GND) U$30.P$1(A) U$31.P$1(A) U$32.P$1(A) U$33.P$1(A) U$34.P$1(A) U$35.P$5(GND) U$39.P$5(GND) U$41.P$1(GND1) U$41.P$7(GND2) U$42.3(A) U$43.3(A) U$44.3(A) U$45.P$1(A) U$46.3(A) U$47.3(A) U$48.GND U$48.OV U$51.GND U$51.OV U$55.2(S) U$56.P$3(GND) U$57.P$1(GND) U$58.2(S) U$60.P$3(A) U$61.P$3(A) U$62.3(A) U$63.P$1(A) U$64.P$1(A) U$66.P$1(A) U$67.P$1(A) U$68.P$1(A) V-THRUST_CURR_ADC.P$7(GND) V-THRUST_LED.P$2(C) V-THRUST_OUT.P$2 V-THRUST_VOLTAGE.P$3(GND)
N$1: R26.1 U$48.HGATE
N$2: LED3.P$1(A) R43.1
N$3: LED1.P$1(A) R39.1
N$4: C30.1 JP4.2 U$7.BA(B) U$7.BB(B) U$24.6(OUT) U$24.7(OUT) U$24.8(OUT) U$45.P$2(C)
N$5: I2C_SHIFT.P$7(VREF2) I2C_SHIFT.P$8(EN) R1.1
N$8: JP2.2 U$41.P$3(!INHIBIT!)
N$9: C23.1 JP3.1 R4.2 U$21.3(A) U$24.2(IN)
N$10: R6.P$1 U$41.P$4(VOADJUST)
N$11: C3.1 U$2.P$6(FILTER)
N$12: C9.1 U$8.P$6(FILTER)
N$13: C6.1 U$4.P$6(FILTER)
N$14: JP1.2 U$25.P$3(!INHIBIT!)
N$15: U$4.P$3(IP-) U$4.P$4(IP-) U$6.P$1
N$16: R5.P$1 U$25.P$4(VOADJUST)
N$17: U$8.P$3(IP-) U$8.P$4(IP-) U$9.P$1
N$18: C12.1 U$11.P$6(FILTER)
N$19: C4.1 U$48.TMR
N$20: U$11.P$3(IP-) U$11.P$4(IP-) U$12.P$1
N$21: C15.1 U$14.P$6(FILTER)
N$22: R23.2 R28.1
N$23: R26.2 U$49.1(G)
N$24: U$14.P$3(IP-) U$14.P$4(IP-) U$15.P$1
N$25: C18.1 U$17.P$6(FILTER)
N$26: R12.1 U$48.SENSE U$50.TAB(D)
N$27: U$17.P$3(IP-) U$17.P$4(IP-) U$18.P$1
N$28: C29.1 U$23.P$6(FILTER)
N$29: U$48.DGATE U$50.1(G)
N$30: U$23.P$3(IP-) U$23.P$4(IP-) U$27.P$1
N$31: C37.1 U$29.P$6(FILTER)
N$33: C20.1 U$19.P$6(FILTER)
N$34: U$5.P$1 U$5.P$2 U$19.P$3(IP-) U$19.P$4(IP-)
N$35: R13.2 R17.1 U$51.UV
N$36: R14.1 R20.2 U$51.FB
N$37: U$29.P$3(IP-) U$29.P$4(IP-) U$37.P$1
N$38: C57.1 U$39.P$6(FILTER)
N$39: R9.2 R27.1 U$48.UV
N$41: R16.1 U$51.HGATE
N$42: C27.1 U$51.TMR
N$43: R14.2 R19.1
N$44: R16.2 U$52.1(G)
N$45: U$51.SOURCE U$52.3(S) U$53.3(S)
N$46: R15.1 U$51.SENSE U$53.TAB(D)
N$47: U$39.P$3(IP-) U$39.P$4(IP-) U$40.P$1
N$48: U$51.DGATE U$53.1(G)
N$49: 12V_VOLTAGE.P$1(IN+) 12V_VOLTAGE.P$2(IN-) R25.2
N$50: R23.1 R24.2 U$48.FB
N$51: C60.1 R22.2 U$56.P$2(IN)
N$52: C31.1 U$35.P$6(FILTER)
N$53: U$19.P$7(VIOUT) V-THRUST_CURR_ADC.P$4(VIN)
N$54: U$48.SOURCE U$49.3(S) U$50.3(S)
N$55: U$2.P$3(IP-) U$2.P$4(IP-) U$20.P$1
N$56: U$35.P$3(IP-) U$35.P$4(IP-) U$36.P$1
N$57: 5V_CURR_ADC.P$4(VIN) U$2.P$7(VIOUT)
N$58: R30.2 V-THRUST_VOLTAGE.P$1(IN+) V-THRUST_VOLTAGE.P$2(IN-)
N$60: 12V_CURR_ADC.P$4(VIN) U$35.P$7(VIOUT)
N$62: SHDN_JMP.2 U$48.SHDN(!SHDN!) U$51.SHDN(!SHDN!) U$56.P$4(OUT)
N$64: PMOS1.P$1(G) R36.1 U$51.FLT(!FAULT!)
N$67: PMOS2.P$1(G) R41.1 U$48.FLT(!FAULT!)
N$69: R44.1 U$55.3(D)
N$70: LED4.C R44.2
N$71: 5V_LED.P$1(A) R31.1
N$72: R32.1 V-THRUST_LED.P$1(A)
N$73: 12V_LED.P$1(A) R33.1
N$74: 3V3_LED.P$1(A) R34.1
N$75: R46.1 U$58.3(D)
N$76: LED5.P$2(C) R46.2
N$77: 5V_VOLTAGE.P$1(IN+) 5V_VOLTAGE.P$2(IN-) R35.2
N$80: R2.2(S) U$60.P$2(REF) U$65.P$1
N$81: LED6.P$1(A) R48.1 U$60.P$1(C)
N$82: R3.2(S) U$59.P$1 U$61.P$2(REF)
N$83: LED7.P$1(A) R49.1 U$61.P$1(C)
N$84: R47.1 U$51.ENOUT U$58.1(G)
N$85: R45.1 U$48.ENOUT U$55.1(G)
N$86: LED8.P$1(A) R50.1
N$87: LED9.P$1(A) R51.1
N$88: PMOS1.P$2(D) R39.2
N$89: PMOS2.P$2(D) R43.2
SCL: 5V_CURR_ADC.P$1(SCL) 5V_VOLTAGE.P$5(SCL) 12V_CURR_ADC.P$1(SCL) 12V_VOLTAGE.P$5(SCL) I2C.2 R8.1 THRUSTER_CURR_ADC.14(SCL) U1.26(SCL) U$71.P$1 V-THRUST_CURR_ADC.P$1(SCL) V-THRUST_VOLTAGE.P$5(SCL)
SCL1: I2C_SHIFT.P$6(SCL2)
SCL-3V3: BME280.P$4(SCK/SCL) DEPTH_SENS.P$1 I2C_SHIFT.P$3(SCL1) R11.1
SDA: 5V_CURR_ADC.P$8(SDA) 5V_VOLTAGE.P$6(SDA) 12V_CURR_ADC.P$8(SDA) 12V_VOLTAGE.P$6(SDA) I2C.1 R7.1 THRUSTER_CURR_ADC.15(SDA) U1.27(SDA) U$72.P$1 V-THRUST_CURR_ADC.P$8(SDA) V-THRUST_VOLTAGE.P$6(SDA)
SDA1: I2C_SHIFT.P$5(SDA2)
SDA-3V3: BME280.P$3(SDI/SDA) DEPTH_SENS.P$2 I2C_SHIFT.P$4(SDA1) R10.1
SHDN_SW: R22.1 R29.1 SHDN_SW.2 U$62.1(C) U$62.2(C)
T1_CURR: THRUSTER_CURR_ADC.1(CH0) U$4.P$7(VIOUT)
T1_PWM: THRUST1.P$2 U1.6(CH0)
T2_CURR: THRUSTER_CURR_ADC.2(CH1) U$8.P$7(VIOUT)
T2_PWM: THRUST2.P$2 U1.7(CH1)
T3_CURR: THRUSTER_CURR_ADC.3(CH2) U$11.P$7(VIOUT)
T3_PWM: THRUST3.P$2 U1.8(CH2)
T4_CURR: THRUSTER_CURR_ADC.4(CH3) U$14.P$7(VIOUT)
T4_PWM: THRUST4.P$2 U1.9(CH3)
T5_CURR: THRUSTER_CURR_ADC.5(CH4) U$17.P$7(VIOUT)
T5_PWM: THRUST5.P$2 U1.10(CH4)
T6_CURR: THRUSTER_CURR_ADC.6(CH5) U$23.P$7(VIOUT)
T6_PWM: THRUST6.P$2 U1.11(CH5)
T7_CURR: THRUSTER_CURR_ADC.7(CH6) U$29.P$7(VIOUT)
T7_PWM: THRUST7.P$2 U1.12(CH6)
T8_CURR: THRUSTER_CURR_ADC.8(CH7) U$39.P$7(VIOUT)
T8_PWM: THRUST8.P$2 U1.13(CH7)
V_BATT1: BATT1_IN.P$1 C34.1 C61.1 LED4.A PMOS2.P$3(S) R3.3(A) R27.2 R41.2 R45.2 R49.2 R51.2 U$48.VCC U$49.TAB(D) U$57.P$3(VIN) U$68.P$2(C) U$75.P$1
V_BATT2: BATT2_IN.P$1 C35.1 LED5.P$1(A) PMOS1.P$3(S) R2.3(A) R17.2 R36.2 R47.2 R48.2 R50.2 U$51.VCC U$52.TAB(D) U$67.P$2(C) U$74.P$1
V_RELAY: U$7.7A U$7.7B U$19.P$1(IP+) U$19.P$2(IP+)
V_THRUST: C21.1 C43.+ C44.+ C46.1 C47.1 CAMERA1.P$1 CAMERA2.P$1 R30.1 R32.2 U$4.P$1(IP+) U$4.P$2(IP+) U$5.P$3 U$5.P$4 U$8.P$1(IP+) U$8.P$2(IP+) U$11.P$1(IP+) U$11.P$2(IP+) U$14.P$1(IP+) U$14.P$2(IP+) U$17.P$1(IP+) U$17.P$2(IP+) U$23.P$1(IP+) U$23.P$2(IP+) U$29.P$1(IP+) U$29.P$2(IP+) U$32.P$2(C) U$33.P$2(C) U$34.P$2(C) U$39.P$1(IP+) U$39.P$2(IP+) U$54.P$1 V-THRUST_OUT.P$1
V_THRUST1: C10.1 C76.1 THRUST1.P$4 U$6.P$2 U$31.P$2(C)
V_THRUST2: C74.1 C75.1 THRUST2.P$4 U$9.P$2 U$30.P$2(C)
V_THRUST3: C107.1 C108.1 THRUST3.P$4 U$12.P$2 U$26.P$2(C)
V_THRUST4: C80.1 C88.1 THRUST4.P$4 U$15.P$2 U$28.P$2(C)
V_THRUST5: C110.1 C111.1 THRUST5.P$4 U$18.P$2 U$22.P$2(C)
V_THRUST6: C101.1 C102.1 THRUST6.P$4 U$13.P$2(C) U$27.P$2
V_THRUST7: C113.1 C114.1 THRUST7.P$4 U$16.P$2(C) U$37.P$2
V_THRUST8: C104.1 C105.1 THRUST8.P$4 U$10.P$2(C) U$40.P$2
VIN: C17.1 C28.1 C65.1 CIN1.1 CIN2.1 CIN3.1 CIN4.1 R12.2 R15.2 R19.2 R28.2 SHORE_IN.P$1 U$1.P$3(VIN) U$7.2A U$7.2B U$25.P$2(VI) U$41.P$2(VI) U$48.OUT U$51.OUT U$66.P$2(C) U$73.P$1
Unconnected: 5V_CURR_ADC.P$2(ALERT) 12V_CURR_ADC.P$2(ALERT) U1.15(CH8) U1.16(CH9) U1.17(CH10) U1.18(CH11) U1.19(CH12) U1.20(CH13) U1.21(CH14) U1.22(CH15) U$24.3(DEN) U$24.4(IS) V-THRUST_CURR_ADC.P$2(ALERT)

## Notes on the sheet
- External Connectors
- 12V Rail
- 12V DC/DC Converter | 12V Current Sensor and 12V Net | 12V Voltage sensor
- Address: 1010101 (12V ADC)
- Temp Sensor | I2C Level Shift
- Address: 1110111 (0x77)(BME)
- Pulling Rs
- 5V Rail
- 5V DC/DC Converter
- 5V Current Sensor and 5V Net
- 5V Voltage Sensor
- Input Voltage
- Address: 1011001 (5V ADC)
- Embedded System Headers
- LEDs
- Thruster Relay
- V_Thrust Rail
- Thrusters
- V_Thrust Current Sensor and V_Thrust Net
- Address: 1011010 (VIN ADC)
- V_Thrust Voltage Sensor
- Thruster Support
- Address: 1001000 (Thrust ADC)
- The blue LED will turn on when the battery
  voltage drops below a level given by:
  
                      (2.5V)(10kO)
                  -----------------
                          POT
  
  where POT is the resistance of the potentiometer.

## Library data of the parts
3V3_IN 5V_OUT 12V_OUT CAMERA1 CAMERA2 EMB_5V ETHERNET FAN1 FAN2 V-THRUST_OUT = molex:KK254_VERT_2PIN: KK® 254 Wire-to-Board Header, Vertical, with Friction Lock, 2 Circuits, Gold (Au) Plating Part Number: 22-29-2021 http://www.molex.com/molex/products/datasheet.jsp?part=active/0022292021_PCB_HEADERS.xml
3V3_LED 5V_LED 12V_LED LED1 LED3 LED5-LED9 V-THRUST_LED = led:0805_LED: LED, 0805 package. Any variety.
5V_CURR_ADC 12V_CURR_ADC V-THRUST_CURR_ADC = texas:ADC121C021: ADC121C021 8-pin VSSOP package 1 channel, 12-bit I2C ADC Datasheet <http://www.ti.com/lit/ds/symlink/adc121c021.pdf>
5V_VOLTAGE 12V_VOLTAGE V-THRUST_VOLTAGE = texas:INA219: TI INA219 Voltage/Current/Power monitor with I2C Datasheet <http://www.ti.com/lit/ds/symlink/ina219.pdf>
BATT1_IN BATT2_IN SHORE_IN = molex:2_SUPERSABRE: Molex SuperSabre 2-pin vertical header
BME280 = BME280ComponentLibrary:BME280; PROD_ID: IC-13090
C1-C23 C27-C31 C33-C37 C40 C45-C49 C51 C53 C57 C59-C62 C64-C66 C69-C85 C88 C93 C94 C101-C114 CIN1-CIN4 = resistor:C-US: CAPACITOR, American symbol
C38 C43 C44 C50 = resistor:CPOL-US: POLARIZED CAPACITOR, American symbol
CPU_PWR DEPTH_SENS THRUST1-THRUST8 = molex:KK254_VERT_4PIN: KK® 254 Wire-to-Board Header, Vertical, with Friction Lock, 4 Circuits, Gold (Au) Plating Part Number: 22-29-2041 http://www.molex.com/molex/products/datasheet.jsp?part=active/0022292041_PCB_HEADERS.xml
I2C JP3 JP4 SHDN_JMP SHDN_SW = pinhead:PINHD-1X2: PIN HEADER
I2C_SHIFT = texas:PCA9306: TI I2C/SMBus Level Shifter Bidirectional 5V <-> 3V3 Datasheet <http://www.ti.com/lit/ds/symlink/pca9306.pdf>
JP1 JP2 = jumper:JP1E: JUMPER
LED4 = led:LED: LED OSRAM: - CHIPLED LG R971, LG N971, LY N971, LG Q971, LY Q971, LO R971, LY R971 LH N974, LH R974 LS Q976, LO Q976, LY Q976 LO Q996 - Hyper CHIPLED LW Q18S LB Q993, LB Q99A, LB R99A - SideLED LS A670, LO A670, LY A670, LG A670, LP A670 LB A673, LV A673, LT A673, LW A673 LH A674 LY A675 LS A676, LA A676, LO A676, LY A676, LW A676 LS A679, LY A679, LG A679 - Hyper Micro SIDELED® LS Y876, LA Y876, LO Y876, LY Y876 LT Y87S - SmartLED LW L88C, LW L88S LB L89C, LB L89S, LG L890 LS L89K, LO L89K, LY L89K LS L896, LA L896, LO L896, LY L896 - TOPLED LS T670, LO T670, LY T670, LG T670, LP T670 LSG T670, LSP T670, LSY T670, LOP T670, LYG T670 LG T671, LOG T671, LSG T671 LB T673, LV T673, LT T673, LW T673 LH T674 LS T676, LA T676, LO T676, LY T676, LB T676, LH T676, LSB T676, LW T676 LB T67C, LV T67C, LT T67C, LS T67K, LO T67K, LY T67K, LW E67C LS E67B, LA E67B, LO E67B, LY E67B, LB E67C, LV E67C, LT E67C LW T67C LS T679, LY T679, LG T679 LS T770, LO T770, LY T770, LG T770, LP T770 LB T773, LV T773, LT T773, LW T773 LH T774 LS E675, LA E675, LY E675, LS T675 LS T776, LA T776, LO T776, LY T776, LB T776 LHGB T686 LT T68C, LB T68C - Hyper Mini TOPLED® LB M676 - Mini TOPLED Santana® LG M470 LS M47K, LO M47K, LY M47K Source: http://www.osram.convergy.de LUXEON: - LUMILED® LXK2-PW12-R00, LXK2-PW12-S00, LXK2-PW14-U00, LXK2-PW14-V00 LXK2-PM12-R00, LXK2-PM12-S00, LXK2-PM14-U00 LXK2-PE12-Q00, LXK2-PE12-R00, LXK2-PE12-S00, LXK2-PE14-T00, LXK2-PE14-U00 LXK2-PB12-K00, LXK2-PB12-L00, LXK2-PB12-M00, LXK2-PB14-N00, LXK2-PB14-P00, LXK2-PB14-Q00 LXK2-PR12-L00, LXK2-PR12-M00, LXK2-PR14-Q00, LXK2-PR14-R00 LXK2-PD12-Q00, LXK2-PD12-R00, LXK2-PD12-S00 LXK2-PH12-R00, LXK2-PH12-S00 LXK2-PL12-P00, LXK2-PL12-Q00, LXK2-PL12-R00 Source: www.luxeon.com KINGBRIGHT: KA-3528ASYC Source: www.kingbright.com
PMOS1 PMOS2 = transistors:SSM3J353F: Toshiba SSM3J353F Small signal PMOS Datasheet <http://www.mouser.com/ds/2/408/SSM3J353F_datasheet_en_20161219-981025.pdf>
R1 R4-R17 R19 R20 R22-R36 R39 R41 R43-R51 = resistor:R-US_: RESISTOR, American symbol
R2 R3 = resistor:R-TRIMM: Trimm resistor
THRUSTER_CURR_ADC = texas:ADS7828: Texas Instruments ADS7828 8-channel 12-bit I2C ADC Datasheet <http://www.ti.com/lit/ds/symlink/ads7828.pdf>
U1 = NXP:PCA9685: 16-channel 12-bit PWM I2C interface Internal Oscillator 40Hz to 1kHz Can be totem pole or open collector 2.3V to 5.5V; PROD_ID: IC-12240
U$1 U$57 = ONSemi:NCP1117: ON Semiconductor NCP1117 5V 1A Fixed LDO Datasheet <http://www.mouser.com/ds/2/308/NCP1117-D-81326.pdf>
U$2 U$4 U$8 U$11 U$14 U$17 U$19 U$23 U$29 U$35 U$39 = allegro:ACS713
U$3 U$54 U$59 U$65 U$69-U$75 = resistor:TEST_PT
U$5 = littelfuse:BOWED-1.25"-FUSECLIPS: Littelfuse 1.25" fuse clips with bowed leads
U$6 U$9 U$12 U$15 U$18 U$20 U$27 U$36 U$37 U$40 = littelfuse:154-OMNI_BLOK: Littelfuse NANO2 Series 154 Omni-Blok fuseholder Datasheet <http://www.mouser.com/ds/2/240/Littelfuse_Fuse_154_154T_154L_154TL_Datasheet.pdf-309941.pdf>
U$7 = TE:KUHP-5XX1-XX: TE Connectivity KUHP-Series Relay Panel relays with quick-connect terminals Relay Datasheet <http://www.mouser.com/ds/2/418/NG_DS_1308242_KUHP_0914_KUHP_0914-713261.pdf> IMPORTANT NOTE: This part is designed using female PCB-mount spade terminals. Part: Keystone Electronics 0.25"x0.032" PC quick-fit terminals (Part No. 3528). Datasheet <http://www.mouser.com/ds/2/215/528-745365.pdf>
U$10 U$13 U$16 U$21 U$22 U$26 U$28 U$30-U$34 U$42-U$47 U$62-U$64 U$66-U$68 = diode:VTVS: Vishay VTVS5V0ASMF to VTVS63GSMF 400W TVS diodes Datasheet <http://www.mouser.com/ds/2/427/vtvs5v0asmf-1078013.pdf>
U$24 = switches:BTS5090-1EJA: Infineon BST5090-1EJA Smart High-Side Power Switch Datasheet <http://www.mouser.com/ds/2/196/Infineon-BTS5090-DS-v02_02-en-596813.pdf>
U$25 U$41 = texas:PTN
U$38 = nonelectrical_mounting:ARDUINO_UNO: Arduino Uno Mechanical layout only Mounting holes spec'd.
U$48 U$51 = linear:LTC4364
U$49 U$50 U$52 U$53 = transistors:STD95N2LH5: ST STD95N2LH5 NMOS Power FET Datasheet <http://www.mouser.com/ds/2/389/std95n2lh5-955773.pdf>
U$55 U$58 = transistor-fet:BSS138CT-ND: ON Semiconductor BSS138 N-MOSFET, Logic Level Datasheet <http://www.mouser.com/ds/2/149/BSS138-1006682.pdf>
U$56 = NXP:74LVC1G14: Nexperia 74LVC1G14 Single Schmitt trigger inverter Datasheet <http://www.mouser.com/ds/2/302/74LVC1G14_Q100-839654.pdf>
U$60 U$61 = texas:TL431: Texas Instruments TL431 Adjustable shunt regulator Datasheet <http://www.ti.com/lit/ds/symlink/tl431.pdf>